# Altium project MAR_modems_board_A1.PrjPcb (part 1 of 2)
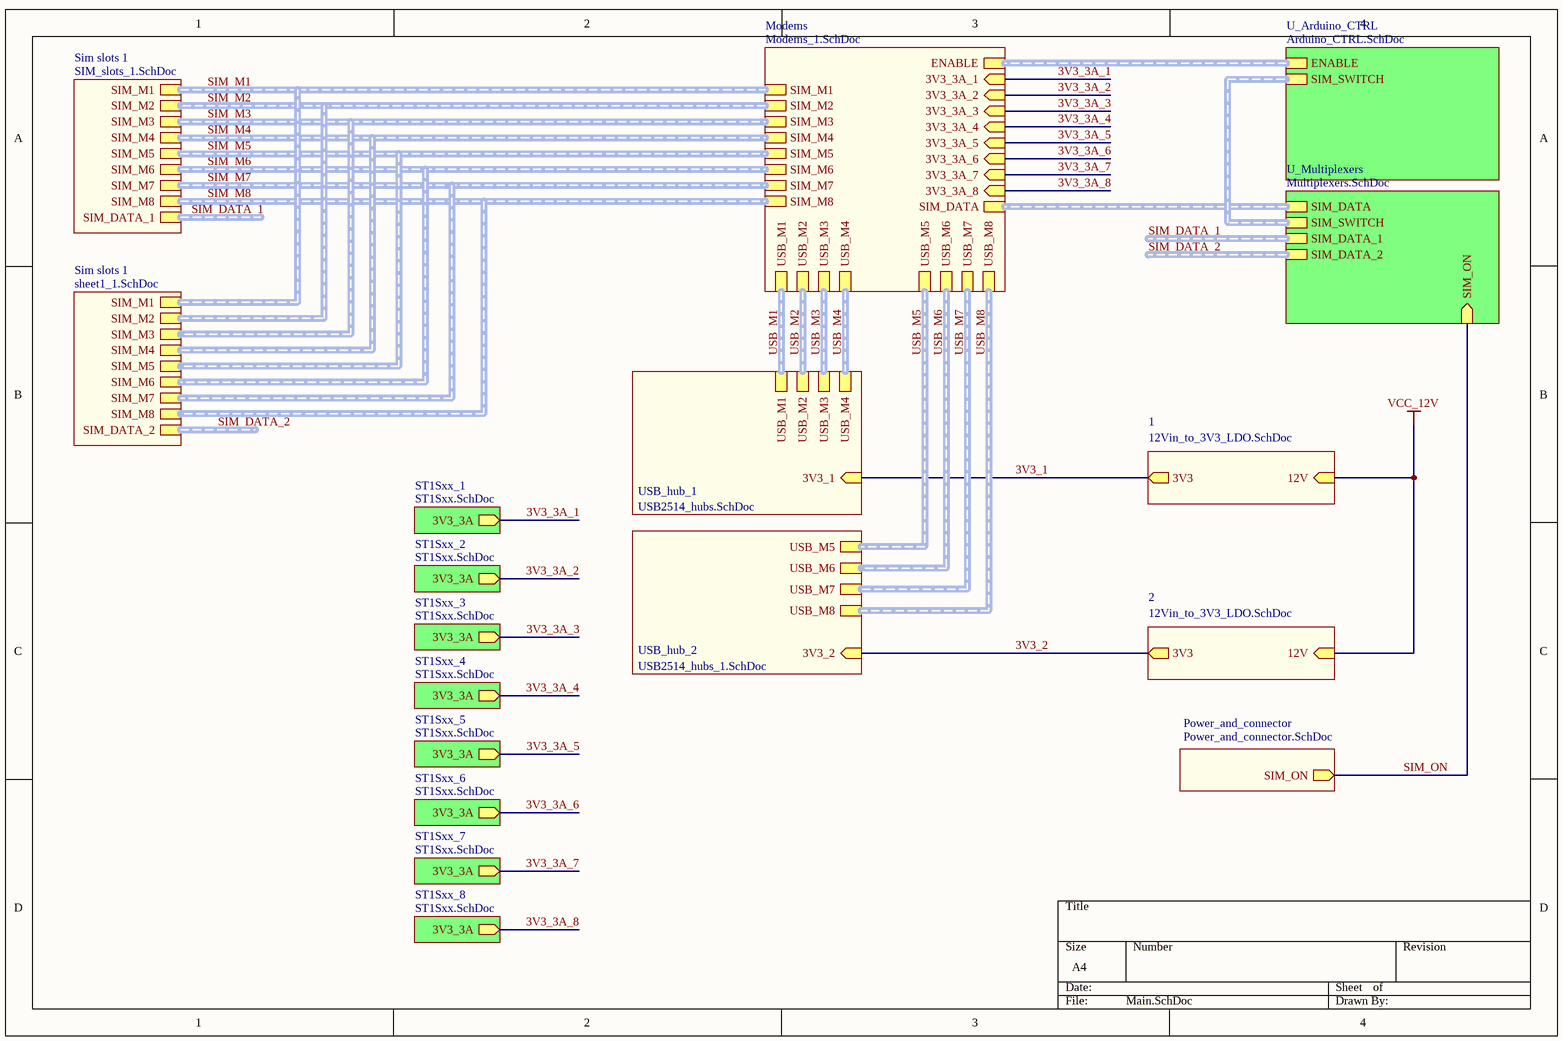
[diagram p0: Main.SchDoc]
11 sheets, 394 parts. Net scope: hierarchical (ports join the sheet entries above them; power ports are global).
Board file: MAR_modems_board_A0_wf_9.PcbDoc
Sheets:
  Main.SchDoc
    Sim slots 1 = SIM_slots_1.SchDoc
    Modems = Modems_1.SchDoc
    USB_hub_1 = USB2514_hubs.SchDoc
    Power_and_connector = Power_and_connector.SchDoc
    USB_hub_2 = USB2514_hubs_1.SchDoc
    1 = 12Vin_to_3V3_LDO.SchDoc
    2 = 12Vin_to_3V3_LDO.SchDoc
    U_Arduino_CTRL = Arduino_CTRL.SchDoc
    U_Multiplexers = Multiplexers.SchDoc
    ST1Sxx_1 = ST1Sxx.SchDoc
    ST1Sxx_2 = ST1Sxx.SchDoc
    ST1Sxx_3 = ST1Sxx.SchDoc
    ST1Sxx_4 = ST1Sxx.SchDoc
    ST1Sxx_5 = ST1Sxx.SchDoc
    ST1Sxx_6 = ST1Sxx.SchDoc
    ST1Sxx_7 = ST1Sxx.SchDoc
    ST1Sxx_8 = ST1Sxx.SchDoc
    Sim slots 1 = Sheet1_1.SchDoc

## Sheet Main.SchDoc
size A4

### Sub-sheets
1 = 12Vin_to_3V3_LDO.SchDoc: 3V3 (out), 12V (in)
2 = 12Vin_to_3V3_LDO.SchDoc: 3V3 (out), 12V (in)
Modems = Modems_1.SchDoc: SIM_M4 (harness SIM), SIM_M5 (harness SIM), SIM_M6 (harness SIM), SIM_M7 (harness SIM), USB_M5 (harness DIFF), USB_M6 (harness DIFF), USB_M8 (harness DIFF), USB_M7 (harness DIFF), USB_M2 (harness DIFF), USB_M4 (harness DIFF), USB_M3 (harness DIFF), USB_M1 (harness DIFF), SIM_M8 (harness SIM), SIM_M3 (harness SIM), SIM_M2 (harness SIM), SIM_M1 (harness SIM), 3V3_3A_4 (in), 3V3_3A_3 (in), 3V3_3A_2 (in), 3V3_3A_1 (in), SIM_DATA (harness SIM_DATA), ENABLE (harness ENABLE), 3V3_3A_6 (in), 3V3_3A_5 (in), 3V3_3A_8 (in), 3V3_3A_7 (in)
Power_and_connector = Power_and_connector.SchDoc: SIM_ON (out)
Sim slots 1 = SIM_slots_1.SchDoc: SIM_M4 (harness SIM), SIM_M5 (harness SIM), SIM_M2 (harness SIM), SIM_M3 (harness SIM), SIM_M6 (harness SIM), SIM_M1 (harness SIM), SIM_M7 (harness SIM), SIM_M8 (harness SIM), SIM_DATA_1 (harness SIM_DATA)
Sim slots 1 = sheet1_1.SchDoc: SIM_M4 (harness SIM), SIM_M5 (harness SIM), SIM_M2 (harness SIM), SIM_M3 (harness SIM), SIM_M6 (harness SIM), SIM_M1 (harness SIM), SIM_M7 (harness SIM), SIM_M8 (harness SIM), SIM_DATA_2 (harness SIM_DATA)
ST1Sxx_1 = ST1Sxx.SchDoc: 3V3_3A (out)
ST1Sxx_2 = ST1Sxx.SchDoc: 3V3_3A (out)
ST1Sxx_3 = ST1Sxx.SchDoc: 3V3_3A (out)
ST1Sxx_4 = ST1Sxx.SchDoc: 3V3_3A (out)
ST1Sxx_5 = ST1Sxx.SchDoc: 3V3_3A (out)
ST1Sxx_6 = ST1Sxx.SchDoc: 3V3_3A (out)
ST1Sxx_7 = ST1Sxx.SchDoc: 3V3_3A (out)
ST1Sxx_8 = ST1Sxx.SchDoc: 3V3_3A (out)
U_Arduino_CTRL = Arduino_CTRL.SchDoc: ENABLE (harness ENABLE), SIM_SWITCH (harness SIM_SWITCH)
U_Multiplexers = Multiplexers.SchDoc: SIM_DATA (harness SIM_DATA), SIM_SWITCH (harness SIM_SWITCH), SIM_DATA_2 (harness SIM_DATA), SIM_DATA_1 (harness SIM_DATA), SIM_ON (in)
USB_hub_1 = USB2514_hubs.SchDoc: USB_M1 (harness DIFF), USB_M2 (harness DIFF), USB_M4 (harness DIFF), USB_M3 (harness DIFF), 3V3_1 (in)
USB_hub_2 = USB2514_hubs_1.SchDoc: USB_M8 (harness DIFF), USB_M7 (harness DIFF), USB_M6 (harness DIFF), USB_M5 (harness DIFF), 3V3_2 (in)

### Nets
VCC_12V: sheet 1/12V, sheet 2/12V
3V3_1: sheet USB_hub_1/3V3_1, sheet 1/3V3
3V3_2: sheet USB_hub_2/3V3_2, sheet 2/3V3
3V3_3A_1: sheet Modems/3V3_3A_1, sheet ST1Sxx_1/3V3_3A
3V3_3A_2: sheet Modems/3V3_3A_2, sheet ST1Sxx_2/3V3_3A
3V3_3A_3: sheet Modems/3V3_3A_3, sheet ST1Sxx_3/3V3_3A
3V3_3A_4: sheet Modems/3V3_3A_4, sheet ST1Sxx_4/3V3_3A
3V3_3A_5: sheet Modems/3V3_3A_5, sheet ST1Sxx_5/3V3_3A
3V3_3A_6: sheet Modems/3V3_3A_6, sheet ST1Sxx_6/3V3_3A
3V3_3A_7: sheet Modems/3V3_3A_7, sheet ST1Sxx_7/3V3_3A
3V3_3A_8: sheet Modems/3V3_3A_8, sheet ST1Sxx_8/3V3_3A
SIM_ON: sheet Power_and_connector/SIM_ON, sheet U_Multiplexers/SIM_ON

### Buses and harness runs
harness sheet Modems/ENABLE = sheet U_Arduino_CTRL/ENABLE
harness sheet Modems/SIM_DATA = sheet U_Multiplexers/SIM_DATA
harness sheet U_Arduino_CTRL/SIM_SWITCH = sheet U_Multiplexers/SIM_SWITCH
harness SIM_DATA_1 = sheet Sim slots 1/SIM_DATA_1
harness SIM_DATA_1 = sheet U_Multiplexers/SIM_DATA_1
harness SIM_DATA_2 = sheet Sim slots 1/SIM_DATA_2
harness SIM_DATA_2 = sheet U_Multiplexers/SIM_DATA_2
harness SIM_M1 = sheet Modems/SIM_M1 = sheet Sim slots 1/SIM_M1
harness SIM_M2 = sheet Modems/SIM_M2 = sheet Sim slots 1/SIM_M2
harness SIM_M3 = sheet Modems/SIM_M3 = sheet Sim slots 1/SIM_M3
harness SIM_M4 = sheet Modems/SIM_M4 = sheet Sim slots 1/SIM_M4
harness SIM_M5 = sheet Modems/SIM_M5 = sheet Sim slots 1/SIM_M5
harness SIM_M6 = sheet Modems/SIM_M6 = sheet Sim slots 1/SIM_M6
harness SIM_M7 = sheet Modems/SIM_M7 = sheet Sim slots 1/SIM_M7
harness SIM_M8 = sheet Modems/SIM_M8 = sheet Sim slots 1/SIM_M8
harness USB_M1 = sheet Modems/USB_M1 = sheet USB_hub_1/USB_M1
harness USB_M2 = sheet Modems/USB_M2 = sheet USB_hub_1/USB_M2
harness USB_M3 = sheet Modems/USB_M3 = sheet USB_hub_1/USB_M3
harness USB_M4 = sheet Modems/USB_M4 = sheet USB_hub_1/USB_M4
harness USB_M5 = sheet Modems/USB_M5 = sheet USB_hub_2/USB_M5
harness USB_M6 = sheet Modems/USB_M6 = sheet USB_hub_2/USB_M6
harness USB_M7 = sheet Modems/USB_M7 = sheet USB_hub_2/USB_M7
harness USB_M8 = sheet Modems/USB_M8 = sheet USB_hub_2/USB_M8

## Sheet SIM_slots_1.SchDoc
size A3
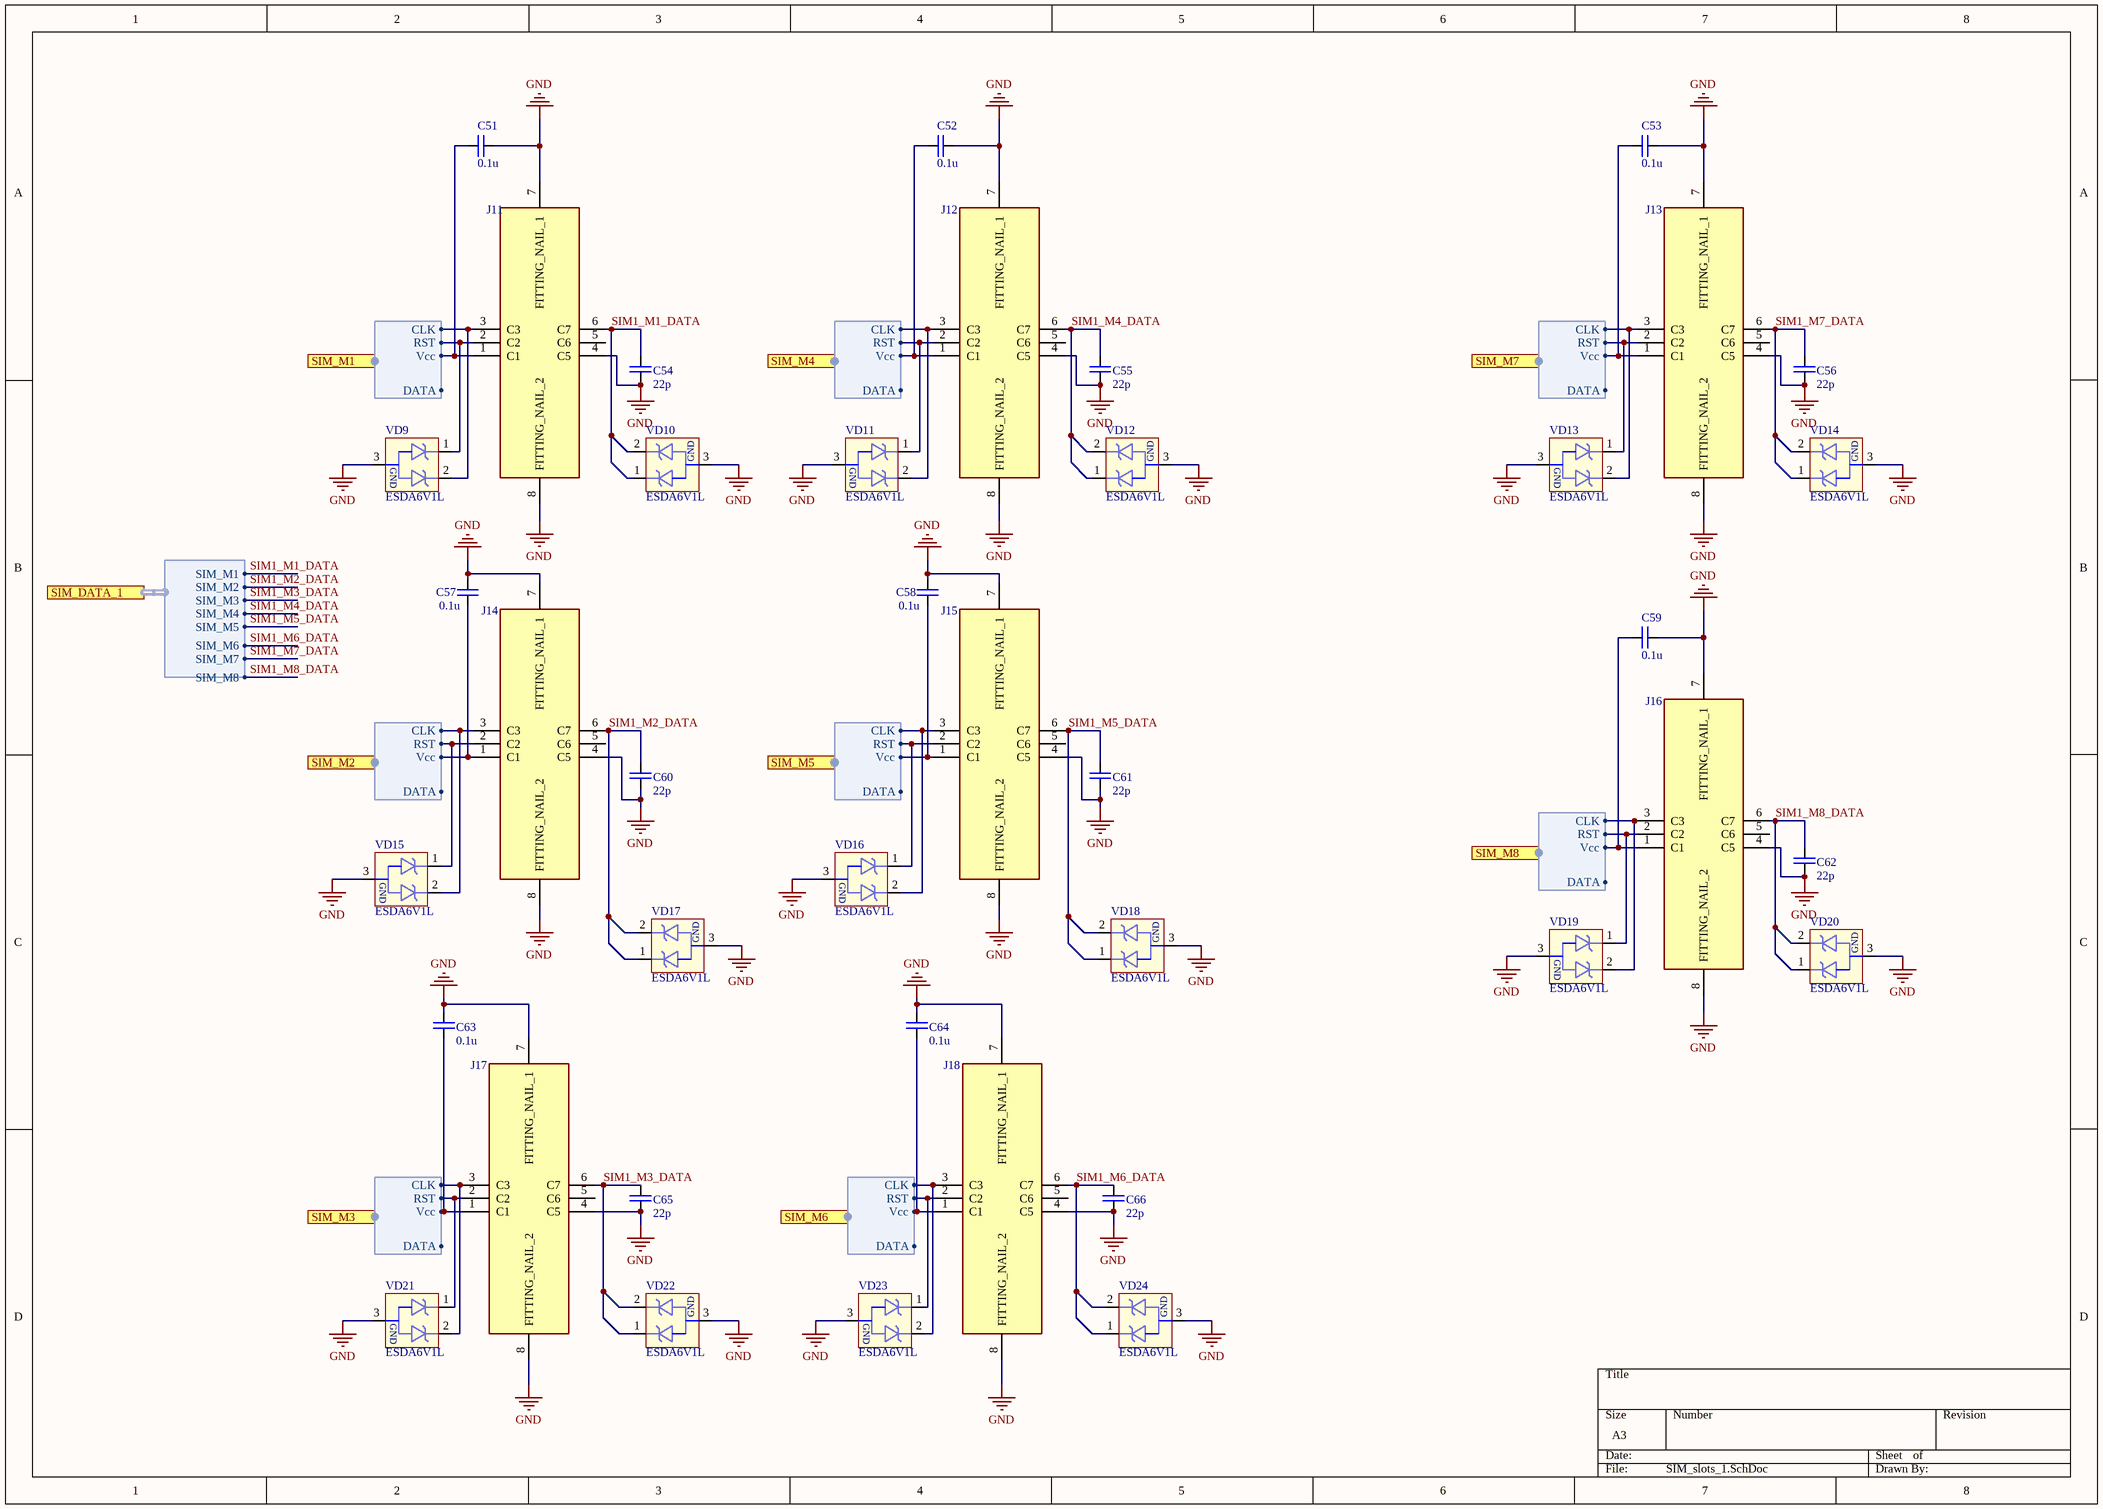
[diagram p1: SIM_slots_1.SchDoc]

### Parts
C51  value 0.1u  [C0402]  (hidden comment: Конденсатор SMD, 0.1мкФ, X7R, 25В, 10%, 0402)
C52  value 0.1u  [C0402]  (hidden comment: Конденсатор SMD, 0.1мкФ, X7R, 25В, 10%, 0402)
C53  value 0.1u  [C0402]  (hidden comment: Конденсатор SMD, 0.1мкФ, X7R, 25В, 10%, 0402)
C54  value 22p  [C0402]  (hidden comment: Конденсатор SMD, 22пФ, X7R, 50В, 10%, 0402)
C55  value 22p  [C0402]  (hidden comment: Конденсатор SMD, 22пФ, X7R, 50В, 10%, 0402)
C56  value 22p  [C0402]  (hidden comment: Конденсатор SMD, 22пФ, X7R, 50В, 10%, 0402)
C57  value 0.1u  [C0402]  (hidden comment: Конденсатор SMD, 0.1мкФ, X7R, 25В, 10%, 0402)
C58  value 0.1u  [C0402]  (hidden comment: Конденсатор SMD, 0.1мкФ, X7R, 25В, 10%, 0402)
C59  value 0.1u  [C0402]  (hidden comment: Конденсатор SMD, 0.1мкФ, X7R, 25В, 10%, 0402)
C60  value 22p  [C0402]  (hidden comment: Конденсатор SMD, 22пФ, X7R, 50В, 10%, 0402)
C61  value 22p  [C0402]  (hidden comment: Конденсатор SMD, 22пФ, X7R, 50В, 10%, 0402)
C62  value 22p  [C0402]  (hidden comment: Конденсатор SMD, 22пФ, X7R, 50В, 10%, 0402)
C63  value 0.1u  [C0402]  (hidden comment: Конденсатор SMD, 0.1мкФ, X7R, 25В, 10%, 0402)
C64  value 0.1u  [C0402]  (hidden comment: Конденсатор SMD, 0.1мкФ, X7R, 25В, 10%, 0402)
C65  value 22p  [C0402]  (hidden comment: Конденсатор SMD, 22пФ, X7R, 50В, 10%, 0402)
C66  value 22p  [C0402]  (hidden comment: Конденсатор SMD, 22пФ, X7R, 50В, 10%, 0402)
J11  47388-2001  [473882001]  (value not drawn)
J12  47388-2001  [473882001]  (value not drawn)
J13  47388-2001  [473882001]  (value not drawn)
J14  47388-2001  [473882001]  (value not drawn)
J15  47388-2001  [473882001]  (value not drawn)
J16  47388-2001  [473882001]  (value not drawn)
J17  47388-2001  [473882001]  (value not drawn)
J18  47388-2001  [473882001]  (value not drawn)
VD9  Диод защитный, ESDA6V1L  [SOT23-3L]  (value not drawn)
VD10  Диод защитный, ESDA6V1L  [SOT23-3L]  (value not drawn)
VD11  Диод защитный, ESDA6V1L  [SOT23-3L]  (value not drawn)
VD12  Диод защитный, ESDA6V1L  [SOT23-3L]  (value not drawn)
VD13  Диод защитный, ESDA6V1L  [SOT23-3L]  (value not drawn)
VD14  Диод защитный, ESDA6V1L  [SOT23-3L]  (value not drawn)
VD15  Диод защитный, ESDA6V1L  [SOT23-3L]  (value not drawn)
VD16  Диод защитный, ESDA6V1L  [SOT23-3L]  (value not drawn)
VD17  Диод защитный, ESDA6V1L  [SOT23-3L]  (value not drawn)
VD18  Диод защитный, ESDA6V1L  [SOT23-3L]  (value not drawn)
VD19  Диод защитный, ESDA6V1L  [SOT23-3L]  (value not drawn)
VD20  Диод защитный, ESDA6V1L  [SOT23-3L]  (value not drawn)
VD21  Диод защитный, ESDA6V1L  [SOT23-3L]  (value not drawn)
VD22  Диод защитный, ESDA6V1L  [SOT23-3L]  (value not drawn)
VD23  Диод защитный, ESDA6V1L  [SOT23-3L]  (value not drawn)
VD24  Диод защитный, ESDA6V1L  [SOT23-3L]  (value not drawn)

### Ports
SIM_DATA_1 (harness SIM_DATA_1), SIM_M1 (harness SIM), SIM_M2 (harness SIM), SIM_M3 (harness SIM), SIM_M4 (harness SIM), SIM_M5 (harness SIM), SIM_M6 (harness SIM), SIM_M7 (harness SIM), SIM_M8 (harness SIM)

### Harnesses
SIM: Vcc, RST, CLK, DATA
SIM_DATA_1: SIM_M1, SIM_M2, SIM_M3, SIM_M4, SIM_M5, SIM_M6, SIM_M7, SIM_M8

### Nets
GND: C51.2 C52.2 C53.2 C54.1 C55.1 C56.1 C57.2 C58.2 C59.2 C60.1 C61.1 C62.1 C63.2 C64.2 C65.1 C66.1 J11.4(C5) J11.7(FITTING_NAIL_1) J11.8(FITTING_NAIL_2) J12.4(C5) J12.7(FITTING_NAIL_1) J12.8(FITTING_NAIL_2) J13.4(C5) J13.7(FITTING_NAIL_1) J13.8(FITTING_NAIL_2) J14.4(C5) J14.7(FITTING_NAIL_1) J14.8(FITTING_NAIL_2) J15.4(C5) J15.7(FITTING_NAIL_1) J15.8(FITTING_NAIL_2) J16.4(C5) J16.7(FITTING_NAIL_1) J16.8(FITTING_NAIL_2) J17.4(C5) J17.7(FITTING_NAIL_1) J17.8(FITTING_NAIL_2) J18.4(C5) J18.7(FITTING_NAIL_1) J18.8(FITTING_NAIL_2) VD9.3(GND) VD10.3(GND) VD11.3(GND) VD12.3(GND) VD13.3(GND) VD14.3(GND) VD15.3(GND) VD16.3(GND) VD17.3(GND) VD18.3(GND) VD19.3(GND) VD20.3(GND) VD21.3(GND) VD22.3(GND) VD23.3(GND) VD24.3(GND)
SIM1_M1_DATA: C54.2 J11.6(C7) VD10.1 VD10.2 ; port SIM_DATA_1.SIM_M1
SIM1_M2_DATA: C60.2 J14.6(C7) VD17.1 VD17.2 ; port SIM_DATA_1.SIM_M2
SIM1_M3_DATA: C65.2 J17.6(C7) VD22.1 VD22.2 ; port SIM_DATA_1.SIM_M3
SIM1_M4_DATA: C55.2 J12.6(C7) VD12.1 VD12.2 ; port SIM_DATA_1.SIM_M4
SIM1_M5_DATA: C61.2 J15.6(C7) VD18.1 VD18.2 ; port SIM_DATA_1.SIM_M5
SIM1_M6_DATA: C66.2 J18.6(C7) VD24.1 VD24.2 ; port SIM_DATA_1.SIM_M6
SIM1_M7_DATA: C56.2 J13.6(C7) VD14.1 VD14.2 ; port SIM_DATA_1.SIM_M7
SIM1_M8_DATA: C62.2 J16.6(C7) VD20.1 VD20.2 ; port SIM_DATA_1.SIM_M8
SIM_M1.CLK: J11.3(C3) VD9.2 ; port SIM_M1.CLK
SIM_M1.RST: J11.2(C2) VD9.1 ; port SIM_M1.RST
SIM_M1.Vcc: C51.1 J11.1(C1) ; port SIM_M1.Vcc
SIM_M2.CLK: J14.3(C3) VD15.2 ; port SIM_M2.CLK
SIM_M2.RST: J14.2(C2) VD15.1 ; port SIM_M2.RST
SIM_M2.Vcc: C57.1 J14.1(C1) ; port SIM_M2.Vcc
SIM_M3.CLK: J17.3(C3) VD21.2 ; port SIM_M3.CLK
SIM_M3.RST: J17.2(C2) VD21.1 ; port SIM_M3.RST
SIM_M3.Vcc: C63.1 J17.1(C1) ; port SIM_M3.Vcc
SIM_M4.CLK: J12.3(C3) VD11.2 ; port SIM_M4.CLK
SIM_M4.RST: J12.2(C2) VD11.1 ; port SIM_M4.RST
SIM_M4.Vcc: C52.1 J12.1(C1) ; port SIM_M4.Vcc
SIM_M5.CLK: J15.3(C3) VD16.2 ; port SIM_M5.CLK
SIM_M5.RST: J15.2(C2) VD16.1 ; port SIM_M5.RST
SIM_M5.Vcc: C58.1 J15.1(C1) ; port SIM_M5.Vcc
SIM_M6.CLK: J18.3(C3) VD23.2 ; port SIM_M6.CLK
SIM_M6.RST: J18.2(C2) VD23.1 ; port SIM_M6.RST
SIM_M6.Vcc: C64.1 J18.1(C1) ; port SIM_M6.Vcc
SIM_M7.CLK: J13.3(C3) VD13.2 ; port SIM_M7.CLK
SIM_M7.RST: J13.2(C2) VD13.1 ; port SIM_M7.RST
SIM_M7.Vcc: C53.1 J13.1(C1) ; port SIM_M7.Vcc
SIM_M8.CLK: J16.3(C3) VD19.2 ; port SIM_M8.CLK
SIM_M8.RST: J16.2(C2) VD19.1 ; port SIM_M8.RST
SIM_M8.Vcc: C59.1 J16.1(C1) ; port SIM_M8.Vcc

Not connected (* = marked no-connect by the designer): J11 5(C6); J12 5(C6); J13 5(C6); J14 5(C6); J15 5(C6); J16 5(C6); J17 5(C6); J18 5(C6)

### Library data of the parts
C51-C53 C57-C59 C63 C64 = C0402: Chip Capacitor 0402; Assembly: 0.1u_X7R_25V_10%_0402; Voltage_assembly: 25V; Tolerance: 10%; Voltage: 25В; TemperatureCoeff: X7R; Family: Конденсатор SMD; Capacitance: 0.1мкФ; Package: 0402
C54-C56 C60-C62 C65 C66 = C0402: Chip Capacitor 0402; Assembly: 22p_X7R_50V_10%_0402; Voltage_assembly: 50V; Tolerance: 10%; Voltage: 50В; TemperatureCoeff: X7R; Family: Конденсатор SMD; Capacitance: 22пФ; Package: 0402
J11-J18 = 47388-2001: Connector; Manufacturer_Name: Molex; Datasheet Link: https://www.molex.com/webdocs/datasheets/pdf/en-us/0473882001_MEMORY_CARD_SOCKET.pdf; Height: 1mm; Manufacturer_Part_Number: 47388-2001; Arrow Part Number: 47388-2001; Arrow Price/Stock: https://www.arrow.com/en/products/47388-2001/molex; Mouser Part Number: 538-47388-2001; Mouser Price/Stock: https://www.mouser.co.uk/ProductDetail/Molex/47388-2001?qs=KKUMDL8WE1K2q3cPEOwmLw%3D%3D
VD9-VD24 = ESDA6V1L: Dual diode array for ESD protection; Manufacturer: STMicroelectronics; Family: Диод защитный; Package: SOT23; Assembly: ESDA6V1L; PartNumber: ESDA6V1L

## Sheet Modems_1.SchDoc
size A2
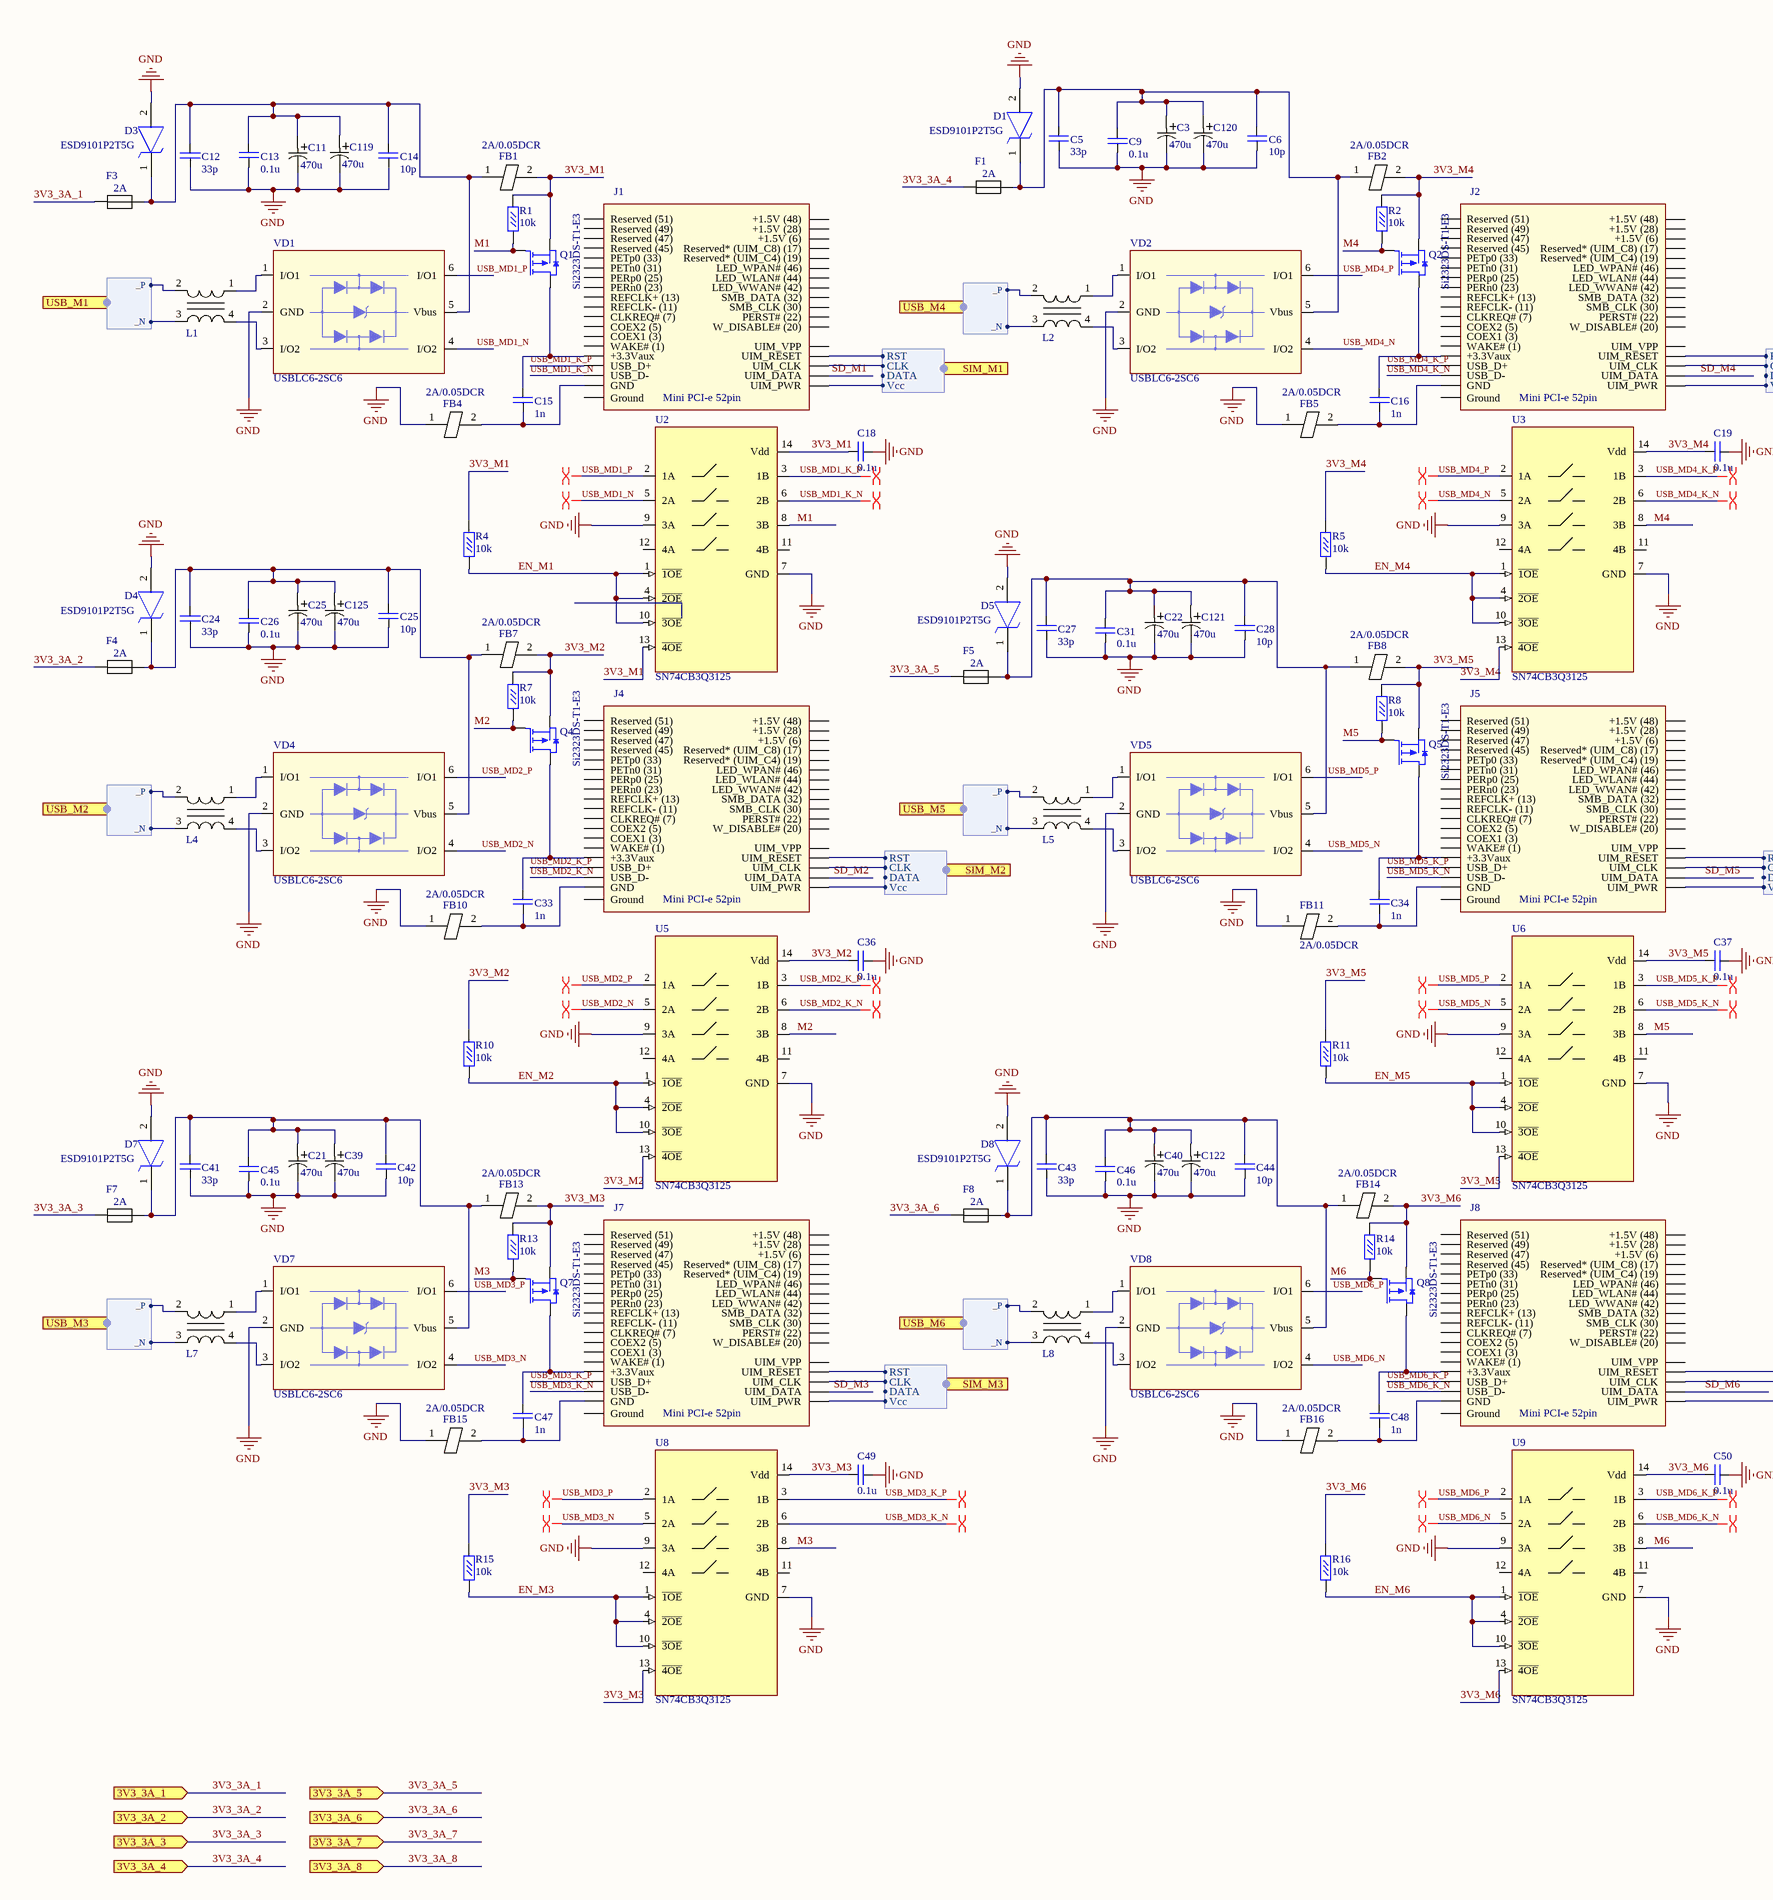
[diagram p2: Modems_1.SchDoc, left]
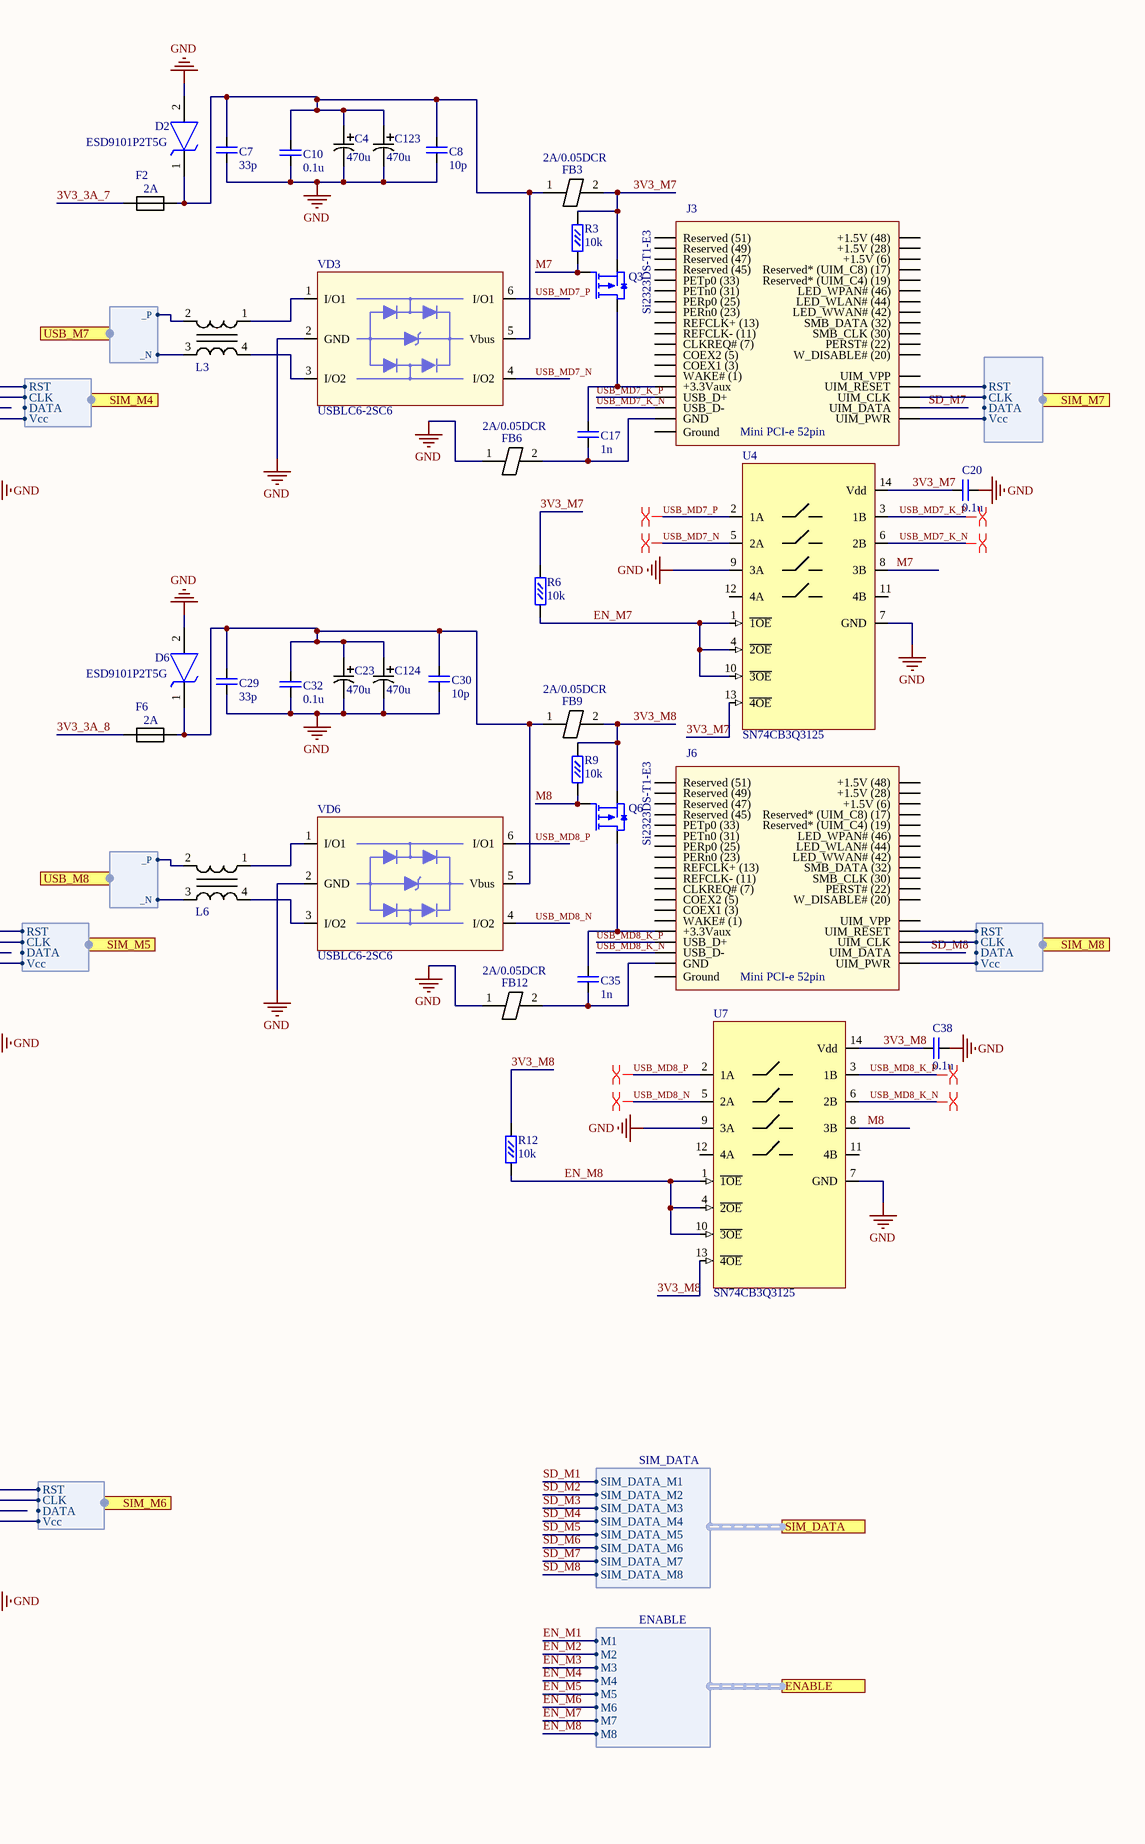
[diagram p3: Modems_1.SchDoc, right]

### Parts
(Parts that share a designator on the sheet are numbered #1, #2 ... from top to bottom, then left to right.)
C3  value 470u  [TAJE_AVX]  (hidden comment: TAJE477K010RNJ)
C4  value 470u  [TAJE_AVX]  (hidden comment: TAJE477K010RNJ)
C5  value 33p  [C0402]  (hidden comment: Конденсатор SMD, 33пФ, X7R, 16В, 10%, 0402)
C6  value 10p  [C0402]  (hidden comment: Конденсатор SMD, 10пФ, X7R, 16В, 10%, 0402)
C7  value 33p  [C0402]  (hidden comment: Конденсатор SMD, 33пФ, X7R, 16В, 10%, 0402)
C8  value 10p  [C0402]  (hidden comment: Конденсатор SMD, 10пФ, X7R, 16В, 10%, 0402)
C9  value 0.1u  [C0402]  (hidden comment: Конденсатор SMD, 0.1мкФ, X7R, 25В, 10%, 0402)
C10  value 0.1u  [C0402]  (hidden comment: Конденсатор SMD, 0.1мкФ, X7R, 25В, 10%, 0402)
C11  value 470u  [TAJE_AVX]  (hidden comment: TAJE477K010RNJ)
C12  value 33p  [C0402]  (hidden comment: Конденсатор SMD, 33пФ, X7R, 16В, 10%, 0402)
C13  value 0.1u  [C0402]  (hidden comment: Конденсатор SMD, 0.1мкФ, X7R, 25В, 10%, 0402)
C14  value 10p  [C0402]  (hidden comment: Конденсатор SMD, 10пФ, X7R, 16В, 10%, 0402)
C15  value 1n  [C0402]  (hidden comment: Конденсатор SMD, 1нФ, X7R, 25В, 10%, 0402)
C16  value 1n  [C0402]  (hidden comment: Конденсатор SMD, 1нФ, X7R, 25В, 10%, 0402)
C17  value 1n  [C0402]  (hidden comment: Конденсатор SMD, 1нФ, X7R, 25В, 10%, 0402)
C18  value 0.1u  [C0402]  (hidden comment: Конденсатор SMD, 0.1мкФ, X7R, 25В, 10%, 0402)
C19  value 0.1u  [C0402]  (hidden comment: Конденсатор SMD, 0.1мкФ, X7R, 25В, 10%, 0402)
C20  value 0.1u  [C0402]  (hidden comment: Конденсатор SMD, 0.1мкФ, X7R, 25В, 10%, 0402)
C21  value 470u  [TAJE_AVX]  (hidden comment: TAJE477K010RNJ)
C22  value 470u  [TAJE_AVX]  (hidden comment: TAJE477K010RNJ)
C23  value 470u  [TAJE_AVX]  (hidden comment: TAJE477K010RNJ)
C24  value 33p  [C0402]  (hidden comment: Конденсатор SMD, 33пФ, X7R, 16В, 10%, 0402)
C25#1  value 470u  [TAJE_AVX]  (hidden comment: TAJE477K010RNJ)
C25#2  value 10p  [C0402]  (hidden comment: Конденсатор SMD, 10пФ, X7R, 16В, 10%, 0402)
C26  value 0.1u  [C0402]  (hidden comment: Конденсатор SMD, 0.1мкФ, X7R, 25В, 10%, 0402)
C27  value 33p  [C0402]  (hidden comment: Конденсатор SMD, 33пФ, X7R, 16В, 10%, 0402)
C28  value 10p  [C0402]  (hidden comment: Конденсатор SMD, 10пФ, X7R, 16В, 10%, 0402)
C29  value 33p  [C0402]  (hidden comment: Конденсатор SMD, 33пФ, X7R, 16В, 10%, 0402)
C30  value 10p  [C0402]  (hidden comment: Конденсатор SMD, 10пФ, X7R, 16В, 10%, 0402)
C31  value 0.1u  [C0402]  (hidden comment: Конденсатор SMD, 0.1мкФ, X7R, 25В, 10%, 0402)
C32  value 0.1u  [C0402]  (hidden comment: Конденсатор SMD, 0.1мкФ, X7R, 25В, 10%, 0402)
C33  value 1n  [C0402]  (hidden comment: Конденсатор SMD, 1нФ, X7R, 25В, 10%, 0402)
C34  value 1n  [C0402]  (hidden comment: Конденсатор SMD, 1нФ, X7R, 25В, 10%, 0402)
C35  value 1n  [C0402]  (hidden comment: Конденсатор SMD, 1нФ, X7R, 25В, 10%, 0402)
C36  value 0.1u  [C0402]  (hidden comment: Конденсатор SMD, 0.1мкФ, X7R, 25В, 10%, 0402)
C37  value 0.1u  [C0402]  (hidden comment: Конденсатор SMD, 0.1мкФ, X7R, 25В, 10%, 0402)
C38  value 0.1u  [C0402]  (hidden comment: Конденсатор SMD, 0.1мкФ, X7R, 25В, 10%, 0402)
C39  value 470u  [TAJE_AVX]  (hidden comment: TAJE477K010RNJ)
C40  value 470u  [TAJE_AVX]  (hidden comment: TAJE477K010RNJ)
C41  value 33p  [C0402]  (hidden comment: Конденсатор SMD, 33пФ, X7R, 16В, 10%, 0402)
C42  value 10p  [C0402]  (hidden comment: Конденсатор SMD, 10пФ, X7R, 16В, 10%, 0402)
C43  value 33p  [C0402]  (hidden comment: Конденсатор SMD, 33пФ, X7R, 16В, 10%, 0402)
C44  value 10p  [C0402]  (hidden comment: Конденсатор SMD, 10пФ, X7R, 16В, 10%, 0402)
C45  value 0.1u  [C0402]  (hidden comment: Конденсатор SMD, 0.1мкФ, X7R, 25В, 10%, 0402)
C46  value 0.1u  [C0402]  (hidden comment: Конденсатор SMD, 0.1мкФ, X7R, 25В, 10%, 0402)
C47  value 1n  [C0402]  (hidden comment: Конденсатор SMD, 1нФ, X7R, 25В, 10%, 0402)
C48  value 1n  [C0402]  (hidden comment: Конденсатор SMD, 1нФ, X7R, 25В, 10%, 0402)
C49  value 0.1u  [C0402]  (hidden comment: Конденсатор SMD, 0.1мкФ, X7R, 25В, 10%, 0402)
C50  value 0.1u  [C0402]  (hidden comment: Конденсатор SMD, 0.1мкФ, X7R, 25В, 10%, 0402)
C119  value 470u  [TAJE_AVX]  (hidden comment: TAJE477K010RNJ)
C120  value 470u  [TAJE_AVX]  (hidden comment: TAJE477K010RNJ)
C121  value 470u  [TAJE_AVX]  (hidden comment: TAJE477K010RNJ)
C122  value 470u  [TAJE_AVX]  (hidden comment: TAJE477K010RNJ)
C123  value 470u  [TAJE_AVX]  (hidden comment: TAJE477K010RNJ)
C124  value 470u  [TAJE_AVX]  (hidden comment: TAJE477K010RNJ)
C125  value 470u  [TAJE_AVX]  (hidden comment: TAJE477K010RNJ)
D1  ESD9101P2T5G  [SODFL1006X40N]
D2  ESD9101P2T5G  [SODFL1006X40N]
D3  ESD9101P2T5G  [SODFL1006X40N]
D4  ESD9101P2T5G  [SODFL1006X40N]
D5  ESD9101P2T5G  [SODFL1006X40N]
D6  ESD9101P2T5G  [SODFL1006X40N]
D7  ESD9101P2T5G  [SODFL1006X40N]
D8  ESD9101P2T5G  [SODFL1006X40N]
F1  Fuse MF-MSMF 2A  [MF-MSMF Fuse]  (value not drawn)
F2  Fuse MF-MSMF 2A  [MF-MSMF Fuse]  (value not drawn)
F3  Fuse MF-MSMF 2A  [MF-MSMF Fuse]  (value not drawn)
F4  Fuse MF-MSMF 2A  [MF-MSMF Fuse]  (value not drawn)
F5  Fuse MF-MSMF 2A  [MF-MSMF Fuse]  (value not drawn)
F6  Fuse MF-MSMF 2A  [MF-MSMF Fuse]  (value not drawn)
F7  Fuse MF-MSMF 2A  [MF-MSMF Fuse]  (value not drawn)
F8  Fuse MF-MSMF 2A  [MF-MSMF Fuse]  (value not drawn)
FB1  2A/0.05DCR  [RESC2012X70N]
FB2  2A/0.05DCR  [RESC2012X70N]
FB3  2A/0.05DCR  [RESC2012X70N]
FB4  2A/0.05DCR  [RESC2012X70N]
FB5  2A/0.05DCR  [RESC2012X70N]
FB6  2A/0.05DCR  [RESC2012X70N]
FB7  2A/0.05DCR  [RESC2012X70N]
FB8  2A/0.05DCR  [RESC2012X70N]
FB9  2A/0.05DCR  [RESC2012X70N]
FB10  2A/0.05DCR  [RESC2012X70N]
FB11  2A/0.05DCR  [RESC2012X70N]
FB12  2A/0.05DCR  [RESC2012X70N]
FB13  2A/0.05DCR  [RESC2012X70N]
FB14  2A/0.05DCR  [RESC2012X70N]
FB15  2A/0.05DCR  [RESC2012X70N]
FB16  2A/0.05DCR  [RESC2012X70N]
J1  Mini PCI-e 52pin  [Mini PCI-E 52pin 2 mnt]
J2  Mini PCI-e 52pin  [Mini PCI-E 52pin 2 mnt]
J3  Mini PCI-e 52pin  [Mini PCI-E 52pin 2 mnt]
J4  Mini PCI-e 52pin  [Mini PCI-E 52pin 2 mnt]
J5  Mini PCI-e 52pin  [Mini PCI-E 52pin 2 mnt]
J6  Mini PCI-e 52pin  [Mini PCI-E 52pin 2 mnt]
J7  Mini PCI-e 52pin  [Mini PCI-E 52pin 2 mnt]
J8  Mini PCI-e 52pin  [Mini PCI-E 52pin 2 mnt]
L1  Inductor ESD (Choke)  [EMI Choke Murata]  (value not drawn)
L2  Inductor ESD (Choke)  [EMI Choke Murata]  (value not drawn)
L3  Inductor ESD (Choke)  [EMI Choke Murata]  (value not drawn)
L4  Inductor ESD (Choke)  [EMI Choke Murata]  (value not drawn)
L5  Inductor ESD (Choke)  [EMI Choke Murata]  (value not drawn)
L6  Inductor ESD (Choke)  [EMI Choke Murata]  (value not drawn)
L7  Inductor ESD (Choke)  [EMI Choke Murata]  (value not drawn)
L8  Inductor ESD (Choke)  [EMI Choke Murata]  (value not drawn)
Q1  Транзистор, Si2323DS-T1-E3  [SOT23]  (value not drawn)
Q2  Транзистор, Si2323DS-T1-E3  [SOT23]  (value not drawn)
Q3  Транзистор, Si2323DS-T1-E3  [SOT23]  (value not drawn)
Q4  Транзистор, Si2323DS-T1-E3  [SOT23]  (value not drawn)
Q5  Транзистор, Si2323DS-T1-E3  [SOT23]  (value not drawn)
Q6  Транзистор, Si2323DS-T1-E3  [SOT23]  (value not drawn)
Q7  Транзистор, Si2323DS-T1-E3  [SOT23]  (value not drawn)
Q8  Транзистор, Si2323DS-T1-E3  [SOT23]  (value not drawn)
R1  value 10k  [R0603]  (hidden comment: Резистор SMD, 0.1Вт, 0603, 10кОм, 1%)
R2  value 10k  [R0603]  (hidden comment: Резистор SMD, 0.1Вт, 0603, 10кОм, 1%)
R3  value 10k  [R0603]  (hidden comment: Резистор SMD, 0.1Вт, 0603, 10кОм, 1%)
R4  value 10k  [R0603]  (hidden comment: Резистор SMD, 0.1Вт, 0603, 10кОм, 1%)
R5  value 10k  [R0603]  (hidden comment: Резистор SMD, 0.1Вт, 0603, 10кОм, 1%)
R6  value 10k  [R0603]  (hidden comment: Резистор SMD, 0.1Вт, 0603, 10кОм, 1%)
R7  value 10k  [R0603]  (hidden comment: Резистор SMD, 0.1Вт, 0603, 10кОм, 1%)
R8  value 10k  [R0603]  (hidden comment: Резистор SMD, 0.1Вт, 0603, 10кОм, 1%)
R9  value 10k  [R0603]  (hidden comment: Резистор SMD, 0.1Вт, 0603, 10кОм, 1%)
R10  value 10k  [R0603]  (hidden comment: Резистор SMD, 0.1Вт, 0603, 10кОм, 1%)
R11  value 10k  [R0603]  (hidden comment: Резистор SMD, 0.1Вт, 0603, 10кОм, 1%)
R12  value 10k  [R0603]  (hidden comment: Резистор SMD, 0.1Вт, 0603, 10кОм, 1%)
R13  value 10k  [R0603]  (hidden comment: Резистор SMD, 0.1Вт, 0603, 10кОм, 1%)
R14  value 10k  [R0603]  (hidden comment: Резистор SMD, 0.1Вт, 0603, 10кОм, 1%)
R15  value 10k  [R0603]  (hidden comment: Резистор SMD, 0.1Вт, 0603, 10кОм, 1%)
R16  value 10k  [R0603]  (hidden comment: Резистор SMD, 0.1Вт, 0603, 10кОм, 1%)
U2  Микросхема, SN74CB3Q3125  [14-TSOP]  (value not drawn)
U3  Микросхема, SN74CB3Q3125  [14-TSOP]  (value not drawn)
U4  Микросхема, SN74CB3Q3125  [14-TSOP]  (value not drawn)
U5  Микросхема, SN74CB3Q3125  [14-TSOP]  (value not drawn)
U6  Микросхема, SN74CB3Q3125  [14-TSOP]  (value not drawn)
U7  Микросхема, SN74CB3Q3125  [14-TSOP]  (value not drawn)
U8  Микросхема, SN74CB3Q3125  [14-TSOP]  (value not drawn)
U9  Микросхема, SN74CB3Q3125  [14-TSOP]  (value not drawn)
VD1  TVS Diode  [SOT23-6L]  (value not drawn)
VD2  TVS Diode  [SOT23-6L]  (value not drawn)
VD3  TVS Diode  [SOT23-6L]  (value not drawn)
VD4  TVS Diode  [SOT23-6L]  (value not drawn)
VD5  TVS Diode  [SOT23-6L]  (value not drawn)
VD6  TVS Diode  [SOT23-6L]  (value not drawn)
VD7  TVS Diode  [SOT23-6L]  (value not drawn)
VD8  TVS Diode  [SOT23-6L]  (value not drawn)

### Ports
3V3_3A_1 (in), 3V3_3A_2 (in), 3V3_3A_3 (in), 3V3_3A_4 (in), 3V3_3A_5 (in), 3V3_3A_6 (in), 3V3_3A_7 (in), 3V3_3A_8 (in), ENABLE (harness ENABLE), SIM_DATA (harness SIM_DATA), SIM_M1 (harness SIM), SIM_M2 (harness SIM), SIM_M3 (harness SIM), SIM_M4 (harness SIM), SIM_M5 (harness SIM), SIM_M6 (harness SIM), SIM_M7 (harness SIM), SIM_M8 (harness SIM), USB_M1 (harness DIFF), USB_M2 (harness DIFF), USB_M3 (harness DIFF), USB_M4 (harness DIFF), USB_M5 (harness DIFF), USB_M6 (harness DIFF), USB_M7 (harness DIFF), USB_M8 (harness DIFF)

### Harnesses
SIM: Vcc, RST, CLK, DATA
DIFF: _P, _N
SIM_DATA: SIM_DATA_M1, SIM_DATA_M2, SIM_DATA_M3, SIM_DATA_M4, SIM_DATA_M5, SIM_DATA_M6, SIM_DATA_M7, SIM_DATA_M8
ENABLE: M1, M2, M3, M4, M5, M6, M7, M8

### Nets
GND: C3.2 C4.2 C5.1 C6.1 C7.1 C8.1 C9.2 C10.2 C11.2 C12.1 C13.2 C14.1 C18.2 C19.2 C20.2 C21.2 C22.2 C23.2 C24.1 C25#1.2 C25#2.1 C26.2 C27.1 C28.1 C29.1 C30.1 C31.2 C32.2 C36.2 C37.2 C38.2 C39.2 C40.2 C41.1 C42.1 C43.1 C44.1 C45.2 C46.2 C49.2 C50.2 C119.2 C120.2 C121.2 C122.2 C123.2 C124.2 C125.2 D1.2(A) D2.2(A) D3.2(A) D4.2(A) D5.2(A) D6.2(A) D7.2(A) D8.2(A) FB4.1 FB5.1 FB6.1 FB10.1 FB11.1 FB12.1 FB15.1 FB16.1 U2.7(GND) U2.9(3A) U3.7(GND) U3.9(3A) U4.7(GND) U4.9(3A) U5.7(GND) U5.9(3A) U6.7(GND) U6.9(3A) U7.7(GND) U7.9(3A) U8.7(GND) U8.9(3A) U9.7(GND) U9.9(3A) VD1.2(GND) VD2.2(GND) VD3.2(GND) VD4.2(GND) VD5.2(GND) VD6.2(GND) VD7.2(GND) VD8.2(GND)
3V3_3A_1: F3.1 ; port 3V3_3A_1
3V3_3A_2: F4.1 ; port 3V3_3A_2
3V3_3A_3: F7.1 ; port 3V3_3A_3
3V3_3A_4: F1.1 ; port 3V3_3A_4
3V3_3A_5: F5.1 ; port 3V3_3A_5
3V3_3A_6: F8.1 ; port 3V3_3A_6
3V3_3A_7: F2.1 ; port 3V3_3A_7
3V3_3A_8: F6.1 ; port 3V3_3A_8
3V3_M1: C18.1 FB1.2 Q1.2(S) R1.2 R4.2 U2.13(~{4OE}) U2.14(Vdd)
3V3_M2: C36.1 FB7.2 Q4.2(S) R7.2 R10.2 U5.13(~{4OE}) U5.14(Vdd)
3V3_M3: C49.1 FB13.2 Q7.2(S) R13.2 R15.2 U8.13(~{4OE}) U8.14(Vdd)
3V3_M4: C19.1 FB2.2 Q2.2(S) R2.2 R5.2 U3.13(~{4OE}) U3.14(Vdd)
3V3_M5: C37.1 FB8.2 Q5.2(S) R8.2 R11.2 U6.13(~{4OE}) U6.14(Vdd)
3V3_M6: C50.1 FB14.2 Q8.2(S) R14.2 R16.2 U9.13(~{4OE}) U9.14(Vdd)
3V3_M7: C20.1 FB3.2 Q3.2(S) R3.2 R6.2 U4.13(~{4OE}) U4.14(Vdd)
3V3_M8: C38.1 FB9.2 Q6.2(S) R9.2 R12.2 U7.13(~{4OE}) U7.14(Vdd)
EN_M1: R4.1 U2.1(~{1OE}) U2.4(~{2OE}) U2.10(~{3OE}) ; port ENABLE.M1
EN_M2: R10.1 U5.1(~{1OE}) U5.4(~{2OE}) U5.10(~{3OE}) ; port ENABLE.M2
EN_M3: R15.1 U8.1(~{1OE}) U8.4(~{2OE}) U8.10(~{3OE}) ; port ENABLE.M3
EN_M4: R5.1 U3.1(~{1OE}) U3.4(~{2OE}) U3.10(~{3OE}) ; port ENABLE.M4
EN_M5: R11.1 U6.1(~{1OE}) U6.4(~{2OE}) U6.10(~{3OE}) ; port ENABLE.M5
EN_M6: R16.1 U9.1(~{1OE}) U9.4(~{2OE}) U9.10(~{3OE}) ; port ENABLE.M6
EN_M7: R6.1 U4.1(~{1OE}) U4.4(~{2OE}) U4.10(~{3OE}) ; port ENABLE.M7
EN_M8: R12.1 U7.1(~{1OE}) U7.4(~{2OE}) U7.10(~{3OE}) ; port ENABLE.M8
M1: Q1.1(G) R1.1 U2.8(3B)
M2: Q4.1(G) R7.1 U5.8(3B)
M3: Q7.1(G) R13.1 U8.8(3B)
M4: Q2.1(G) R2.1 U3.8(3B)
M5: Q5.1(G) R8.1 U6.8(3B)
M6: Q8.1(G) R14.1 U9.8(3B)
M7: Q3.1(G) R3.1 U4.8(3B)
M8: Q6.1(G) R9.1 U7.8(3B)
SD_M1: J1.10(UIM_DATA) ; port SIM_DATA.SIM_DATA_M1
SD_M2: J4.10(UIM_DATA) ; port SIM_DATA.SIM_DATA_M2
SD_M3: J7.10(UIM_DATA) ; port SIM_DATA.SIM_DATA_M3
SD_M4: J2.10(UIM_DATA) ; port SIM_DATA.SIM_DATA_M4
SD_M5: J5.10(UIM_DATA) ; port SIM_DATA.SIM_DATA_M5
SD_M6: J8.10(UIM_DATA) ; port SIM_DATA.SIM_DATA_M6
SD_M7: J3.10(UIM_DATA) ; port SIM_DATA.SIM_DATA_M7
SD_M8: J6.10(UIM_DATA) ; port SIM_DATA.SIM_DATA_M8
SIM_M1.CLK: J1.12(UIM_CLK) ; port SIM_M1.CLK
SIM_M1.RST: J1.14(UIM_RESET) ; port SIM_M1.RST
SIM_M1.Vcc: J1.8(UIM_PWR) ; port SIM_M1.Vcc
SIM_M2.CLK: J4.12(UIM_CLK) ; port SIM_M2.CLK
SIM_M2.RST: J4.14(UIM_RESET) ; port SIM_M2.RST
SIM_M2.Vcc: J4.8(UIM_PWR) ; port SIM_M2.Vcc
SIM_M3.CLK: J7.12(UIM_CLK) ; port SIM_M3.CLK
SIM_M3.RST: J7.14(UIM_RESET) ; port SIM_M3.RST
SIM_M3.Vcc: J7.8(UIM_PWR) ; port SIM_M3.Vcc
SIM_M4.CLK: J2.12(UIM_CLK) ; port SIM_M4.CLK
SIM_M4.RST: J2.14(UIM_RESET) ; port SIM_M4.RST
SIM_M4.Vcc: J2.8(UIM_PWR) ; port SIM_M4.Vcc
SIM_M5.CLK: J5.12(UIM_CLK) ; port SIM_M5.CLK
SIM_M5.RST: J5.14(UIM_RESET) ; port SIM_M5.RST
SIM_M5.Vcc: J5.8(UIM_PWR) ; port SIM_M5.Vcc
SIM_M6.CLK: J8.12(UIM_CLK) ; port SIM_M6.CLK
SIM_M6.RST: J8.14(UIM_RESET) ; port SIM_M6.RST
SIM_M6.Vcc: J8.8(UIM_PWR) ; port SIM_M6.Vcc
SIM_M7.CLK: J3.12(UIM_CLK) ; port SIM_M7.CLK
SIM_M7.RST: J3.14(UIM_RESET) ; port SIM_M7.RST
SIM_M7.Vcc: J3.8(UIM_PWR) ; port SIM_M7.Vcc
SIM_M8.CLK: J6.12(UIM_CLK) ; port SIM_M8.CLK
SIM_M8.RST: J6.14(UIM_RESET) ; port SIM_M8.RST
SIM_M8.Vcc: J6.8(UIM_PWR) ; port SIM_M8.Vcc
USB_M1._N: L1.3 ; port USB_M1._N
USB_M1._P: L1.2 ; port USB_M1._P
USB_M2._N: L4.3 ; port USB_M2._N
USB_M2._P: L4.2 ; port USB_M2._P
USB_M3._N: L7.3 ; port USB_M3._N
USB_M3._P: L7.2 ; port USB_M3._P
USB_M4._N: L2.3 ; port USB_M4._N
USB_M4._P: L2.2 ; port USB_M4._P
USB_M5._N: L5.3 ; port USB_M5._N
USB_M5._P: L5.2 ; port USB_M5._P
USB_M6._N: L8.3 ; port USB_M6._N
USB_M6._P: L8.2 ; port USB_M6._P
USB_M7._N: L3.3 ; port USB_M7._N
USB_M7._P: L3.2 ; port USB_M7._P
USB_M8._N: L6.3 ; port USB_M8._N
USB_M8._P: L6.2 ; port USB_M8._P
USB_MD1_K_N: J1.36(USB_D-) U2.6(2B)
USB_MD1_K_P: J1.38(USB_D+) U2.3(1B)
USB_MD1_N: U2.5(2A) VD1.4(I/O2)
USB_MD1_P: U2.2(1A) VD1.6(I/O1)
USB_MD2_K_N: J4.36(USB_D-) U5.6(2B)
USB_MD2_K_P: J4.38(USB_D+) U5.3(1B)
USB_MD2_N: U5.5(2A) VD4.4(I/O2)
USB_MD2_P: U5.2(1A) VD4.6(I/O1)
USB_MD3_K_N: J7.36(USB_D-) U8.6(2B)
USB_MD3_K_P: J7.38(USB_D+) U8.3(1B)
USB_MD3_N: U8.5(2A) VD7.4(I/O2)
USB_MD3_P: U8.2(1A) VD7.6(I/O1)
USB_MD4_K_N: J2.36(USB_D-) U3.6(2B)
USB_MD4_K_P: J2.38(USB_D+) U3.3(1B)
USB_MD4_N: U3.5(2A) VD2.4(I/O2)
USB_MD4_P: U3.2(1A) VD2.6(I/O1)
USB_MD5_K_N: J5.36(USB_D-) U6.6(2B)
USB_MD5_K_P: J5.38(USB_D+) U6.3(1B)
USB_MD5_N: U6.5(2A) VD5.4(I/O2)
USB_MD5_P: U6.2(1A) VD5.6(I/O1)
USB_MD6_K_N: J8.36(USB_D-) U9.6(2B)
USB_MD6_K_P: J8.38(USB_D+) U9.3(1B)
USB_MD6_N: U9.5(2A) VD8.4(I/O2)
USB_MD6_P: U9.2(1A) VD8.6(I/O1)
USB_MD7_K_N: J3.36(USB_D-) U4.6(2B)
USB_MD7_K_P: J3.38(USB_D+) U4.3(1B)
USB_MD7_N: U4.5(2A) VD3.4(I/O2)
USB_MD7_P: U4.2(1A) VD3.6(I/O1)
USB_MD8_K_N: J6.36(USB_D-) U7.6(2B)
USB_MD8_K_P: J6.38(USB_D+) U7.3(1B)
USB_MD8_N: U7.5(2A) VD6.4(I/O2)
USB_MD8_P: U7.2(1A) VD6.6(I/O1)
NetC3_1: C3.1 C5.2 C6.2 C9.1 C120.1 D1.1(K) F1.2 FB2.1 VD2.5(Vbus)
NetC4_1: C4.1 C7.2 C8.2 C10.1 C123.1 D2.1(K) F2.2 FB3.1 VD3.5(Vbus)
NetC11_1: C11.1 C12.2 C13.1 C14.2 C119.1 D3.1(K) F3.2 FB1.1 VD1.5(Vbus)
NetC15_1: C15.1 J1.3v3(+3.3Vaux) Q1.3(D)
NetC15_2: C15.2 FB4.2 J1.GND
NetC16_1: C16.1 J2.3v3(+3.3Vaux) Q2.3(D)
NetC16_2: C16.2 FB5.2 J2.GND
NetC17_1: C17.1 J3.3v3(+3.3Vaux) Q3.3(D)
NetC17_2: C17.2 FB6.2 J3.GND
NetC21_1: C21.1 C39.1 C41.2 C42.2 C45.1 D7.1(K) F7.2 FB13.1 VD7.5(Vbus)
NetC22_1: C22.1 C27.2 C28.2 C31.1 C121.1 D5.1(K) F5.2 FB8.1 VD5.5(Vbus)
NetC23_1: C23.1 C29.2 C30.2 C32.1 C124.1 D6.1(K) F6.2 FB9.1 VD6.5(Vbus)
NetC24_2: C24.2 C25#1.1 C25#2.2 C26.1 C125.1 D4.1(K) F4.2 FB7.1 VD4.5(Vbus)
NetC33_1: C33.1 J4.3v3(+3.3Vaux) Q4.3(D)
NetC33_2: C33.2 FB10.2 J4.GND
NetC34_1: C34.1 J5.3v3(+3.3Vaux) Q5.3(D)
NetC34_2: C34.2 FB11.2 J5.GND
NetC35_1: C35.1 J6.3v3(+3.3Vaux) Q6.3(D)
NetC35_2: C35.2 FB12.2 J6.GND
NetC40_1: C40.1 C43.2 C44.2 C46.1 C122.1 D8.1(K) F8.2 FB14.1 VD8.5(Vbus)
NetC47_1: C47.1 J7.3v3(+3.3Vaux) Q7.3(D)
NetC47_2: C47.2 FB15.2 J7.GND
NetC48_1: C48.1 J8.3v3(+3.3Vaux) Q8.3(D)
NetC48_2: C48.2 FB16.2 J8.GND
NetL1_1: L1.1 VD1.1(I/O1)
NetL1_4: L1.4 VD1.3(I/O2)
NetL2_1: L2.1 VD2.1(I/O1)
NetL2_4: L2.4 VD2.3(I/O2)
NetL3_1: L3.1 VD3.1(I/O1)
NetL3_4: L3.4 VD3.3(I/O2)
NetL4_1: L4.1 VD4.1(I/O1)
NetL4_4: L4.4 VD4.3(I/O2)
NetL5_1: L5.1 VD5.1(I/O1)
NetL5_4: L5.4 VD5.3(I/O2)
NetL6_1: L6.1 VD6.1(I/O1)
NetL6_4: L6.4 VD6.3(I/O2)
NetL7_1: L7.1 VD7.1(I/O1)
NetL7_4: L7.4 VD7.3(I/O2)
NetL8_1: L8.1 VD8.1(I/O1)
NetL8_4: L8.4 VD8.3(I/O2)

Not connected (* = marked no-connect by the designer): J1 0(Ground) 1(WAKE#_(1)) 3(COEX1_(3)) 5(COEX2_(5)) 6(+1.5V_(6)) 7(CLKREQ#_(7)) 11(REFCLK-_(11)) 13(REFCLK+_(13)) 16(UIM_VPP) 17(Reserved*_(UIM_C8)_(17)) 19(Reserved*_(UIM_C4)_(19)) 20(W_DISABLE#_(20)) 22(PERST#_(22)) 23(PERn0_(23)) 25(PERp0_(25)) 28(+1.5V_(28)) 30(SMB_CLK_(30)) 31(PETn0_(31)) 32(SMB_DATA_(32)) 33(PETp0_(33)) 42(LED_WWAN#_(42)) 44(LED_WLAN#_(44)) 45(Reserved_(45)) 46(LED_WPAN#_(46)) 47(Reserved_(47)) 48(+1.5V_(48)) 49(Reserved_(49)) 51(Reserved_(51)); J2 0(Ground) 1(WAKE#_(1)) 3(COEX1_(3)) 5(COEX2_(5)) 6(+1.5V_(6)) 7(CLKREQ#_(7)) 11(REFCLK-_(11)) 13(REFCLK+_(13)) 16(UIM_VPP) 17(Reserved*_(UIM_C8)_(17)) 19(Reserved*_(UIM_C4)_(19)) 20(W_DISABLE#_(20)) 22(PERST#_(22)) 23(PERn0_(23)) 25(PERp0_(25)) 28(+1.5V_(28)) 30(SMB_CLK_(30)) 31(PETn0_(31)) 32(SMB_DATA_(32)) 33(PETp0_(33)) 42(LED_WWAN#_(42)) 44(LED_WLAN#_(44)) 45(Reserved_(45)) 46(LED_WPAN#_(46)) 47(Reserved_(47)) 48(+1.5V_(48)) 49(Reserved_(49)) 51(Reserved_(51)); J3 0(Ground) 1(WAKE#_(1)) 3(COEX1_(3)) 5(COEX2_(5)) 6(+1.5V_(6)) 7(CLKREQ#_(7)) 11(REFCLK-_(11)) 13(REFCLK+_(13)) 16(UIM_VPP) 17(Reserved*_(UIM_C8)_(17)) 19(Reserved*_(UIM_C4)_(19)) 20(W_DISABLE#_(20)) 22(PERST#_(22)) 23(PERn0_(23)) 25(PERp0_(25)) 28(+1.5V_(28)) 30(SMB_CLK_(30)) 31(PETn0_(31)) 32(SMB_DATA_(32)) 33(PETp0_(33)) 42(LED_WWAN#_(42)) 44(LED_WLAN#_(44)) 45(Reserved_(45)) 46(LED_WPAN#_(46)) 47(Reserved_(47)) 48(+1.5V_(48)) 49(Reserved_(49)) 51(Reserved_(51)); J4 0(Ground) 1(WAKE#_(1)) 3(COEX1_(3)) 5(COEX2_(5)) 6(+1.5V_(6)) 7(CLKREQ#_(7)) 11(REFCLK-_(11)) 13(REFCLK+_(13)) 16(UIM_VPP) 17(Reserved*_(UIM_C8)_(17)) 19(Reserved*_(UIM_C4)_(19)) 20(W_DISABLE#_(20)) 22(PERST#_(22)) 23(PERn0_(23)) 25(PERp0_(25)) 28(+1.5V_(28)) 30(SMB_CLK_(30)) 31(PETn0_(31)) 32(SMB_DATA_(32)) 33(PETp0_(33)) 42(LED_WWAN#_(42)) 44(LED_WLAN#_(44)) 45(Reserved_(45)) 46(LED_WPAN#_(46)) 47(Reserved_(47)) 48(+1.5V_(48)) 49(Reserved_(49)) 51(Reserved_(51)); J5 0(Ground) 1(WAKE#_(1)) 3(COEX1_(3)) 5(COEX2_(5)) 6(+1.5V_(6)) 7(CLKREQ#_(7)) 11(REFCLK-_(11)) 13(REFCLK+_(13)) 16(UIM_VPP) 17(Reserved*_(UIM_C8)_(17)) 19(Reserved*_(UIM_C4)_(19)) 20(W_DISABLE#_(20)) 22(PERST#_(22)) 23(PERn0_(23)) 25(PERp0_(25)) 28(+1.5V_(28)) 30(SMB_CLK_(30)) 31(PETn0_(31)) 32(SMB_DATA_(32)) 33(PETp0_(33)) 42(LED_WWAN#_(42)) 44(LED_WLAN#_(44)) 45(Reserved_(45)) 46(LED_WPAN#_(46)) 47(Reserved_(47)) 48(+1.5V_(48)) 49(Reserved_(49)) 51(Reserved_(51)); J6 0(Ground) 1(WAKE#_(1)) 3(COEX1_(3)) 5(COEX2_(5)) 6(+1.5V_(6)) 7(CLKREQ#_(7)) 11(REFCLK-_(11)) 13(REFCLK+_(13)) 16(UIM_VPP) 17(Reserved*_(UIM_C8)_(17)) 19(Reserved*_(UIM_C4)_(19)) 20(W_DISABLE#_(20)) 22(PERST#_(22)) 23(PERn0_(23)) 25(PERp0_(25)) 28(+1.5V_(28)) 30(SMB_CLK_(30)) 31(PETn0_(31)) 32(SMB_DATA_(32)) 33(PETp0_(33)) 42(LED_WWAN#_(42)) 44(LED_WLAN#_(44)) 45(Reserved_(45)) 46(LED_WPAN#_(46)) 47(Reserved_(47)) 48(+1.5V_(48)) 49(Reserved_(49)) 51(Reserved_(51)); J7 0(Ground) 1(WAKE#_(1)) 3(COEX1_(3)) 5(COEX2_(5)) 6(+1.5V_(6)) 7(CLKREQ#_(7)) 11(REFCLK-_(11)) 13(REFCLK+_(13)) 16(UIM_VPP) 17(Reserved*_(UIM_C8)_(17)) 19(Reserved*_(UIM_C4)_(19)) 20(W_DISABLE#_(20)) 22(PERST#_(22)) 23(PERn0_(23)) 25(PERp0_(25)) 28(+1.5V_(28)) 30(SMB_CLK_(30)) 31(PETn0_(31)) 32(SMB_DATA_(32)) 33(PETp0_(33)) 42(LED_WWAN#_(42)) 44(LED_WLAN#_(44)) 45(Reserved_(45)) 46(LED_WPAN#_(46)) 47(Reserved_(47)) 48(+1.5V_(48)) 49(Reserved_(49)) 51(Reserved_(51)); J8 0(Ground) 1(WAKE#_(1)) 3(COEX1_(3)) 5(COEX2_(5)) 6(+1.5V_(6)) 7(CLKREQ#_(7)) 11(REFCLK-_(11)) 13(REFCLK+_(13)) 16(UIM_VPP) 17(Reserved*_(UIM_C8)_(17)) 19(Reserved*_(UIM_C4)_(19)) 20(W_DISABLE#_(20)) 22(PERST#_(22)) 23(PERn0_(23)) 25(PERp0_(25)) 28(+1.5V_(28)) 30(SMB_CLK_(30)) 31(PETn0_(31)) 32(SMB_DATA_(32)) 33(PETp0_(33)) 42(LED_WWAN#_(42)) 44(LED_WLAN#_(44)) 45(Reserved_(45)) 46(LED_WPAN#_(46)) 47(Reserved_(47)) 48(+1.5V_(48)) 49(Reserved_(49)) 51(Reserved_(51)); U2 11(4B) 12(4A); U3 11(4B) 12(4A); U4 11(4B) 12(4A); U5 11(4B) 12(4A); U6 11(4B) 12(4A); U7 11(4B) 12(4A); U8 11(4B) 12(4A); U9 11(4B) 12(4A)

### Layout directives
differential pair: USB_MD1_K_N, USB_MD1_K_P, USB_MD1_N, USB_MD1_P, USB_MD2_K_N, USB_MD2_K_P, USB_MD2_N, USB_MD2_P, USB_MD3_K_N, USB_MD3_K_P, USB_MD3_N, USB_MD3_P, USB_MD4_K_N, USB_MD4_K_P, USB_MD4_N, USB_MD4_P, USB_MD5_K_N, USB_MD5_K_P, USB_MD5_N, USB_MD5_P, USB_MD6_K_N, USB_MD6_K_P, USB_MD6_N, USB_MD6_P, USB_MD7_K_N, USB_MD7_K_P, USB_MD7_N, USB_MD7_P, USB_MD8_K_N, USB_MD8_K_P, USB_MD8_N, USB_MD8_P

### Notes on the sheet
- (in symbol Fuse MF-MSMF 2A) 2A

### Library data of the parts
C3 C4 C11 C21-C23 C25#1 C39 C40 C119-C125 = TAJE477K010RNJ: Chip capacitor 7343; Mfr_Name: KYOCERA AVX; Voltage: 10V; Assembly: 470u_10V_case-E_7343; Family: Конденсатор танталовый SMD; Package: case-E_7343
C5 C7 C12 C24 C27 C29 C41 C43 = C0402: Chip Capacitor 0402; Assembly: 33p_X7R_16V_10%_0402; Voltage_assembly: 16V; Voltage: 16В; Tolerance: 10%; TemperatureCoeff: X7R; Family: Конденсатор SMD; Capacitance: 33пФ; Package: 0402
C6 C8 C14 C25#2 C28 C30 C42 C44 = C0402: Chip Capacitor 0402; Assembly: 10p_X7R_16V_10%_0402; Voltage_assembly: 16V; Voltage: 16В; Tolerance: 10%; TemperatureCoeff: X7R; Family: Конденсатор SMD; Capacitance: 10пФ; Package: 0402
C9 C10 C13 C18-C20 C26 C31 C32 C36-C38 C45 C46 C49 C50 = C0402: as C51 on sheet SIM_slots_1; Tolerance: 10%; Voltage: 25В; TemperatureCoeff: X7R; Family: Конденсатор SMD; Capacitance: 0.1мкФ; Package: 0402
C15-C17 C33-C35 C47 C48 = C0402: Chip Capacitor 0402; Assembly: 1n_X7R_25V_10%_0402; Voltage_assembly: 25V; Tolerance: 10%; Voltage: 25В; TemperatureCoeff: X7R; Family: Конденсатор SMD; Capacitance: 1нФ; Package: 0402
D1-D8 = ESD9101P2T5G: TVS Diode (Uni-directional); Manufacturer_Name: ON Semiconductor; Datasheet Link: http://www.onsemi.com/pub/Collateral/ESD9101-D.PDF; Height: 0.4mm; Manufacturer_Part_Number: ESD9101P2T5G; Family: Диод защитный; PartNumber: ESD9101P2T5G
FB1-FB16 = Ferrite Bead 2A/0.05DCR
L1-L8 = Inductor ESD (Choke): DLW21HN900SQ2L
Q1-Q8 = Si2323DS-T1-E3: P-Shannel Power MOSFET, 3.7A, 1.25 W; Manufacturer: Vishay; Family: Транзистор; Package: SOT23; Assembly: Si2323DS-T1-E3; PartNumber: Si2323DS-T1-E3
R1-R16 = R0603_0.1: Chip Resistor 0603, 0.1 W; Assembly: 10k_0.1W_1%_0603; Power_assembly: 0.1W; Power: 0.1Вт; Tolerance: 1%; Family: Резистор SMD; Package: 0603; Resistance: 10кОм
U2-U9 = SN74CB3Q3125: Quadruple FET Bus Switch; Manufacturer: Texas Instruments; Family: Микросхема; Package: TSSOP-14; PartNumber: SN74CB3Q3125
VD1-VD8 = USBLC6-2SC6: Very low capacitance ESD protection; Manufacturer: STMicroelectronics; Part Number: USBLC6-2SC6

## Sheet USB2514_hubs.SchDoc
size A3
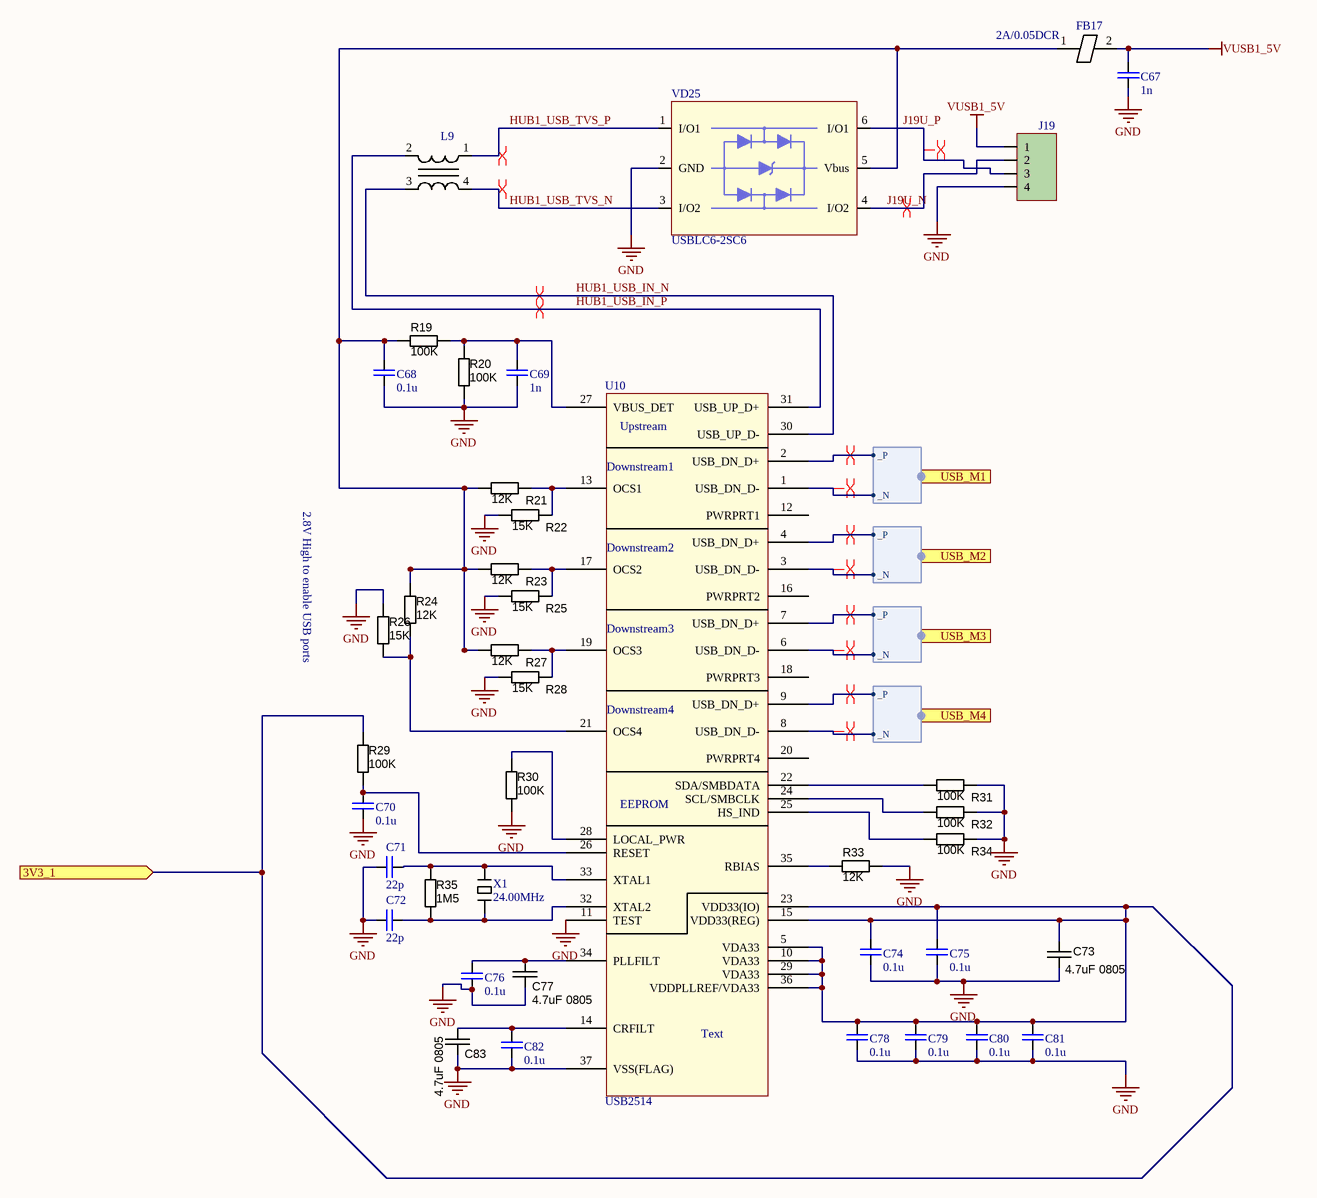
[diagram p4: USB2514_hubs.SchDoc]

### Parts
C67  value 1n  [C0402]  (hidden comment: Конденсатор SMD, 1нФ, X7R, 25В, 10%, 0402)
C68  value 0.1u  [C0402]  (hidden comment: Конденсатор SMD, 0.1мкФ, X7R, 25В, 10%, 0402)
C69  value 1n  [C0402]  (hidden comment: Конденсатор SMD, 1нФ, X7R, 25В, 10%, 0402)
C70  value 0.1u  [C0402]  (hidden comment: Конденсатор SMD, 0.1мкФ, X7R, 25В, 10%, 0402)
C71  value 22p  [C0402]  (hidden comment: Конденсатор SMD, 22пФ, X7R, 50В, 10%, 0402)
C72  value 22p  [C0402]  (hidden comment: Конденсатор SMD, 22пФ, X7R, 50В, 10%, 0402)
C73  value 4.7uF 0805  [CAPC2012X135N]  (hidden comment: approved sub OK)
C74  value 0.1u  [C0402]  (hidden comment: Конденсатор SMD, 0.1мкФ, X7R, 25В, 10%, 0402)
C75  value 0.1u  [C0402]  (hidden comment: Конденсатор SMD, 0.1мкФ, X7R, 25В, 10%, 0402)
C76  value 0.1u  [C0402]  (hidden comment: Конденсатор SMD, 0.1мкФ, X7R, 25В, 10%, 0402)
C77  value 4.7uF 0805  [CAPC2012X135N]  (hidden comment: approved sub OK)
C78  value 0.1u  [C0402]  (hidden comment: Конденсатор SMD, 0.1мкФ, X7R, 25В, 10%, 0402)
C79  value 0.1u  [C0402]  (hidden comment: Конденсатор SMD, 0.1мкФ, X7R, 25В, 10%, 0402)
C80  value 0.1u  [C0402]  (hidden comment: Конденсатор SMD, 0.1мкФ, X7R, 25В, 10%, 0402)
C81  value 0.1u  [C0402]  (hidden comment: Конденсатор SMD, 0.1мкФ, X7R, 25В, 10%, 0402)
C82  value 0.1u  [C0402]  (hidden comment: Конденсатор SMD, 0.1мкФ, X7R, 25В, 10%, 0402)
C83  value 4.7uF 0805  [CAPC2012X135N]  (hidden comment: approved sub OK)
FB17  2A/0.05DCR  [RESC2012X70N]
J19  Разъём (вилка), CWF-4 (DS1069-4 M)  [CWF-4]  (value not drawn)
L9  Inductor ESD (Choke)  [EMI Choke Murata]  (value not drawn)
R19  value 100K  [RESC1005X40N]  (hidden comment: Thick Film)
R20  value 100K  [RESC1005X40N]  (hidden comment: Thick Film)
R21  value 12K  [RESC1005X40N]  (hidden comment: Thick Film)
R22  value 15K  [RESC1005X40N]  (hidden comment: Thick Film)
R23  value 12K  [RESC1005X40N]  (hidden comment: Thick Film)
R24  value 12K  [RESC1005X40N]  (hidden comment: Thick Film)
R25  value 15K  [RESC1005X40N]  (hidden comment: Thick Film)
R26  value 15K  [RESC1005X40N]  (hidden comment: Thick Film)
R27  value 12K  [RESC1005X40N]  (hidden comment: Thick Film)
R28  value 15K  [RESC1005X40N]  (hidden comment: Thick Film)
R29  value 100K  [RESC1005X40N]  (hidden comment: Thick Film)
R30  value 100K  [RESC1005X40N]  (hidden comment: Thick Film)
R31  value 100K  [RESC1005X40N]  (hidden comment: Thick Film)
R32  value 100K  [RESC1005X40N]  (hidden comment: Thick Film)
R33  value 12K  [RESC1005X40N]  (hidden comment: Thick Film)
R34  value 100K  [RESC1005X40N]  (hidden comment: Thick Film)
R35  value 1M5  [RESC1005X40N]  (hidden comment: Thick Film)
U10  USB2514  [USB-2514B 4port Hub]
VD25  TVS Diode  [SOT23-6L]  (value not drawn)
X1  24.00MHz  [Quartz SMD KX-K]

### Ports
3V3_1 (in), USB_M1 (harness DIFF), USB_M2 (harness DIFF), USB_M3 (harness DIFF), USB_M4 (harness DIFF)

### Harnesses
DIFF: _P, _N

### Nets
GND: C67.2 C68.2 C69.2 C70.2 C71.1 C72.1 C73.2 C74.2 C75.2 C76.2 C77.2 C78.2 C79.2 C80.2 C81.2 C82.2 C83.2 J19.4 R20.2 R22.1 R25.1 R26.1 R28.1 R30.2 R31.2 R32.2 R33.2 R34.2 U10.11(TEST) U10.37(VSS(FLAG)) VD25.2(GND)
VUSB1_5V: C67.1 FB17.2 J19.1
3V3_1: C73.1 C74.1 C75.1 C78.1 C79.1 C80.1 C81.1 R29.1 U10.5(VDA33) U10.10(VDA33) U10.15(VDD33(REG)) U10.23(VDD33(IO)) U10.29(VDA33) U10.36(VDDPLLREF/VDA33) ; port 3V3_1
HUB1_USB_IN_N: L9.3 U10.30(USB_UP_D-)
HUB1_USB_IN_P: L9.2 U10.31(USB_UP_D+)
HUB1_USB_TVS_N: L9.4 VD25.3(I/O2)
HUB1_USB_TVS_P: L9.1 VD25.1(I/O1)
J19U_N: J19.2 VD25.4(I/O2)
J19U_P: J19.3 VD25.6(I/O1)
USB_M1._N: U10.1(USB_DN_D-) ; port USB_M1._N
USB_M1._P: U10.2(USB_DN_D+) ; port USB_M1._P
USB_M2._N: U10.3(USB_DN_D-) ; port USB_M2._N
USB_M2._P: U10.4(USB_DN_D+) ; port USB_M2._P
USB_M3._N: U10.6(USB_DN_D-) ; port USB_M3._N
USB_M3._P: U10.7(USB_DN_D+) ; port USB_M3._P
USB_M4._N: U10.8(USB_DN_D-) ; port USB_M4._N
USB_M4._P: U10.9(USB_DN_D+) ; port USB_M4._P
NetC68_1: C68.1 FB17.1 R19.1 R21.1 R23.1 R24.1 R27.1 VD25.5(Vbus)
NetC69_1: C69.1 R19.2 R20.1 U10.27(VBUS_DET)
NetC70_1: C70.1 R29.2 U10.26(RESET)
NetC71_2: C71.2 R35.1 U10.33(XTAL1) X1.2
NetC72_2: C72.2 R35.2 U10.32(XTAL2) X1.1
NetC76_1: C76.1 C77.1 U10.34(PLLFILT)
NetC82_1: C82.1 C83.1 U10.14(CRFILT)
NetR21_2: R21.2 R22.2 U10.13(OCS1)
NetR23_2: R23.2 R25.2 U10.17(OCS2)
NetR24_2: R24.2 R26.2 U10.21(OCS4)
NetR27_2: R27.2 R28.2 U10.19(OCS3)
NetR30_1: R30.1 U10.28(LOCAL_PWR)
NetR31_1: R31.1 U10.22(SDA/SMBDATA)
NetR32_1: R32.1 U10.24(SCL/SMBCLK)
NetR33_1: R33.1 U10.35(RBIAS)
NetR34_1: R34.1 U10.25(HS_IND)

Not connected (* = marked no-connect by the designer): U10 12(PWRPRT1) 16(PWRPRT2) 18(PWRPRT3) 20(PWRPRT4)

### Layout directives
differential pair: HUB1_USB_IN_N, HUB1_USB_IN_P, HUB1_USB_TVS_N, HUB1_USB_TVS_P, J19U_N, J19U_P, USB_M1._N, USB_M1._P, USB_M2._N, USB_M2._P, USB_M3._N, USB_M3._P, USB_M4._N, USB_M4._P

### Notes on the sheet
- 2.8V High to enable USB ports
- (in symbol SMSC USB2514) Upstream; Downstream1; Downstream2; Downstream3; Downstream4; EEPROM; Text

### Library data of the parts
C67 C69 = C0402: as C15 on sheet Modems_1; Tolerance: 10%; Voltage: 25В; TemperatureCoeff: X7R; Family: Конденсатор SMD; Capacitance: 1нФ; Package: 0402
C68 C70 C74-C76 C78-C82 = C0402: as C51 on sheet SIM_slots_1; Tolerance: 10%; Voltage: 25В; TemperatureCoeff: X7R; Family: Конденсатор SMD; Capacitance: 0.1мкФ; Package: 0402
C71 C72 = C0402: as C54 on sheet SIM_slots_1; Tolerance: 10%; Voltage: 50В; TemperatureCoeff: X7R; Family: Конденсатор SMD; Capacitance: 22пФ; Package: 0402
C73 C77 C83 = CAPC_4u7_0805: Capacitor SMD Cer 4.7uF 10% 16V X5R 0805; Manufacturer 1: Taiyo Yuden; Manufacturer Part Number 1: EMK212BJ475KG-T; Ratings: 16V; X5R; Material: ceramic; SCDType: spec; Package / Case: 0805 (2012 Metric); Tolerance: ±10%; Supplier 1: Digi-Key; Supplier Part Number 1: 587-1294-1-ND; Operating Temperature: -55°C ~ 85°C; Size / Dimension: 0.079" L x 0.049" W (2.00mm x 1.25mm); Thickness (Max): 0.053" (1.35mm); ComponentLink1URL: http://www.yuden.co.jp/productdata/catalog/en/mlcc01_e.pdf; ComponentLink1Description: http://www.yuden.co.jp/productdata/catalog/en/mlcc01_e.pdf; Supplier 2: Digi-Key; Supplier Part Number 2: 1276-1065-1-ND; Manufacturer 2: Samsung Electro-Mechanics America, Inc; Manufacturer Part Number 2: CL21A475KOFNNNE; RoHS 2: RoHS Compliant; ComponentLink2URL: http://www.samsungsem.com/servlet/FileDownload?type=spec&file=CL21A475KOFNNNE.pdf; ComponentLink2Description: http://www.samsungsem.com/servlet/FileDownload?type=spec&file=CL21A475KOFNNNE.pdf; Supplier 3: Digi-Key; Supplier Part Number 3: 399-8101-1-ND; Manufacturer 3: Kemet; Manufacturer Part Number 3: C0805C475K4PACTU; RoHS 3: RoHS Compliant; ComponentLink3URL: http://capacitoredge.kemet.com/capedge2/DataSheet?pn=C0805C475K4PACTU; ComponentLink3Description: http://capacitoredge.kemet.com/capedge2/DataSheet?pn=C0805C475K4PACTU; Supplier 4: Digi-Key; Supplier Part Number 4: 490-7215-1-ND; Manufacturer 4: Murata Electronics North America; Manufacturer Part Number 4: GRM21BR61C475MA88L; RoHS 4: RoHS Compliant; ComponentLink4URL: http://psearch.murata.com/capacitor/product/GRM21BR61C475MA88#.pdf; ComponentLink4Description: http://psearch.murata.com/capacitor/product/GRM21BR61C475MA88#.pdf; Supplier 5: Digi-Key; Supplier Part Number 5: 445-7640-1-ND; Manufacturer 5: TDK Corporation; Manufacturer Part Number 5: C2012X5R1C475K125AC; RoHS 5: RoHS Compliant; ComponentLink5URL: http://product.tdk.com/capacitor/mlcc/en/documents/mlcc_commercial_general_en.pdf; ComponentLink5Description: http://product.tdk.com/capacitor/mlcc/en/documents/mlcc_commercial_general_en.pdf; RoHS 1: RoHS Compliant
FB17 = Ferrite Bead 2A/0.05DCR
J19 = CWF-4: 4-pin male though-hole connector, pitch 2.5 mm; Manufacturer: Confly (China); Family: Разъём (вилка); PartNumber: CWF-4 (DS1069-4 M); Assembly: CWF-4; Value: CWF-4
L9 = Inductor ESD (Choke): DLW21HN900SQ2L
R19 R20 R29 R30 = RES_100K_0402_5%: Resistor SMD chip 100k Ohm 0.063W 5% 0402; Manufacturer 1: Vishay Dale; Manufacturer Part Number 1: CRCW0402100KJNED; Ratings: 1/16 W; SCDType: undef; Package / Case: 0402 (1005 Metric); Tolerance: ±5%; ComponentLink2URL: http://www.yageo.com/documents/recent/PYu-RC0402_51_RoHS_L_6.pdf; ComponentLink2Description: http://www.yageo.com/documents/recent/PYu-RC0402_51_RoHS_L_6.pdf; Supplier 1: Digi-Key; Supplier Part Number 1: 541-100KJCT-ND; ComponentLink1URL: http://www.vishay.com/doc?20035; ComponentLink1Description: http://www.vishay.com/doc?20035; Supplier 2: Digi-Key; Supplier Part Number 2: 311-100KJRCT-ND; Manufacturer 2: Yageo; Manufacturer Part Number 2: RC0402JR-07100KL
R21-R28 R31-R34 = RES_1K_0402_5%: Resistor SMD chip 1k Ohm 0.063W 5% 0402; Manufacturer 1: Yageo; Manufacturer Part Number 1: RC0402JR-071KL; Ratings: 1/16 W; SCDType: spec; Package / Case: 0402 (1005 Metric); Tolerance: ±5%; Supplier 1: Digi-Key; Supplier Part Number 1: 311-1.0KJRCT-ND; RoHS 1: RoHS Compliant; ComponentLink1URL: http://www.yageo.com/documents/recent/PYu-RC0402_51_RoHS_L_6.pdf; ComponentLink1Description: http://www.yageo.com/documents/recent/PYu-RC0402_51_RoHS_L_6.pdf; Supplier 2: Digi-Key; Supplier Part Number 2: 541-1.0KJCT-ND; Manufacturer 2: Vishay Dale; Manufacturer Part Number 2: CRCW04021K00JNED; RoHS 2: RoHS Compliant; ComponentLink2URL: http://www.vishay.com/doc?20035; ComponentLink2Description: http://www.vishay.com/doc?20035; Supplier 3: Digi-Key; Supplier Part Number 3: 1276-4376-1-ND; Manufacturer 3: Samsung Electro-Mechanics America, Inc; Manufacturer Part Number 3: RC1005J102CS; RoHS 3: RoHS Compliant; ComponentLink3URL: http://www.samsungsem.com/servlet/FileDownload?filename=productcatalog/pdf/Chip_Resistor.pdf; ComponentLink3Description: http://www.samsungsem.com/servlet/FileDownload?filename=productcatalog/pdf/Chip_Resistor.pdf; Supplier 4: Digi-Key; Supplier Part Number 4: RHM1.0KCECT-ND; Manufacturer 4: Rohm Semiconductor; Manufacturer Part Number 4: MCR01MRTJ102; RoHS 4: RoHS Compliant; ComponentLink4URL: http://rohmfs.rohm.com/en/products/databook/datasheet/passive/resistor/chip_resistor/mcr_g.pdf; ComponentLink4Description: http://rohmfs.rohm.com/en/products/databook/datasheet/passive/resistor/chip_resistor/mcr_g.pdf; Supplier 5: Digi-Key; Supplier Part Number 5: P1.0KJCT-ND; Manufacturer 5: Panasonic Electronic Components; Manufacturer Part Number 5: ERJ-2GEJ102X; RoHS 5: RoHS Compliant; ComponentLink5URL: http://industrial.panasonic.com/www-cgi/jvcr13pz.cgi?E+PZ+3+AOA0001+ERJ2GEJ102X+7+WW; ComponentLink5Description: http://industrial.panasonic.com/www-cgi/jvcr13pz.cgi?E+PZ+3+AOA0001+ERJ2GEJ102X+7+WW
R35 = RES_1M_0402_5%: Resistor SMD chip 1M Ohm 0.063W 5% 0402; Manufacturer 1: Vishay Dale; Manufacturer Part Number 1: CRCW04021M00JNED; Ratings: 1/16 W; Power Rating: 0.063W, 1/16W; SCDType: spec; Package / Case: 0402 (1005 Metric); Tolerance: ±5%; Material: Thick Film; Manufacturer 2: Yageo; Manufacturer Part Number 2: RC0402JR-071ML; Supplier 1: Digi-Key; Supplier Part Number 1: 541-1.0MJCT-ND; ComponentLink1URL: http://www.vishay.com/doc?20035; ComponentLink1Description: http://www.vishay.com/doc?20035; Supplier 2: Digi-Key; Supplier Part Number 2: 311-1.0MJRCT-ND; ComponentLink2URL: http://www.yageo.com/documents/recent/PYu-RC0402_51_RoHS_L_6.pdf; ComponentLink2Description: http://www.yageo.com/documents/recent/PYu-RC0402_51_RoHS_L_6.pdf
U10 = SMSC USB2514: type: USB2514
VD25 = USBLC6-2SC6: as VD1 on sheet Modems_1; Part Number: USBLC6-2SC6
X1 = Quartz: Quartz KX-K

## Sheet Power_and_connector.SchDoc
size A2
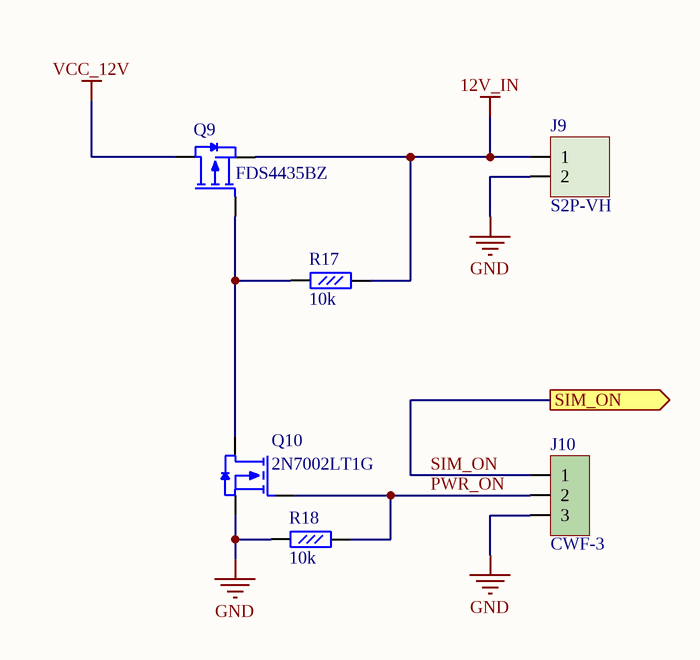
[diagram p5: Power_and_connector.SchDoc]

### Parts
J9  value S2P-VH  [PWL2-02R]  (hidden comment: Разъём (вилка), S2P-VH)
J10  value CWF-3  [CWF-3]  (hidden comment: Разъём (вилка), CWF-3 (DS1069-3 M))
Q9  Транзистор, FDS4435BZ  [SO-8]  (value not drawn)
Q10  PartNumber: 2N7002LT1G  [SOT23]  (hidden comment: Транзистор, 2N7002LT1G)
R17  value 10k  [R0603]  (hidden comment: Резистор SMD, 0.1Вт, 0603, 10кОм, 1%)
R18  value 10k  [R0603]  (hidden comment: Резистор SMD, 0.1Вт, 0603, 10кОм, 1%)

### Ports
SIM_ON (out)

### Nets
12V_IN: J9.1 Q9.1(S) R17.1
GND: J9.2 J10.3 Q10.2(S) R18.2
VCC_12V: Q9.3(D)
PWR_ON: J10.2 Q10.1(G) R18.1
SIM_ON: J10.1 ; port SIM_ON
NetQ9_2: Q9.2(G) Q10.3(D) R17.2

### Library data of the parts
J9 = B2P-VH: 2-pin male header, pitch 3.96 mm; Manufacturer: JST (China); Family: Разъём (вилка); PartNumber: S2P-VH; Assembly: S2P-VH
J10 = CWF-3: 3-pin male though-hole connector, pitch 2.5 mm; Manufacturer: (China); Family: Разъём (вилка); PartNumber: CWF-3 (DS1069-3 M); Assembly: CWF-3
Q9 = FDS4435BZ: P-Shannel 30 V 8A MOSFET; Manufacturer: Fairchild; Family: Транзистор; Package: SO-8; Assembly: FDS4435BZ; PartNumber: FDS4435BZ
Q10 = 2N7002: N-channel OptiMOS™ Small-Signal-Transistor; Manufacturer: Mnf; Family: Транзистор; Package: SOT23; Assembly: 2N7002LT1G
R17 R18 = R0603_0.1: as R1 on sheet Modems_1; Power: 0.1Вт; Tolerance: 1%; Family: Резистор SMD; Package: 0603; Resistance: 10кОм